# Altium project Power_Box_V0.PrjPcb (part 1 of 2)
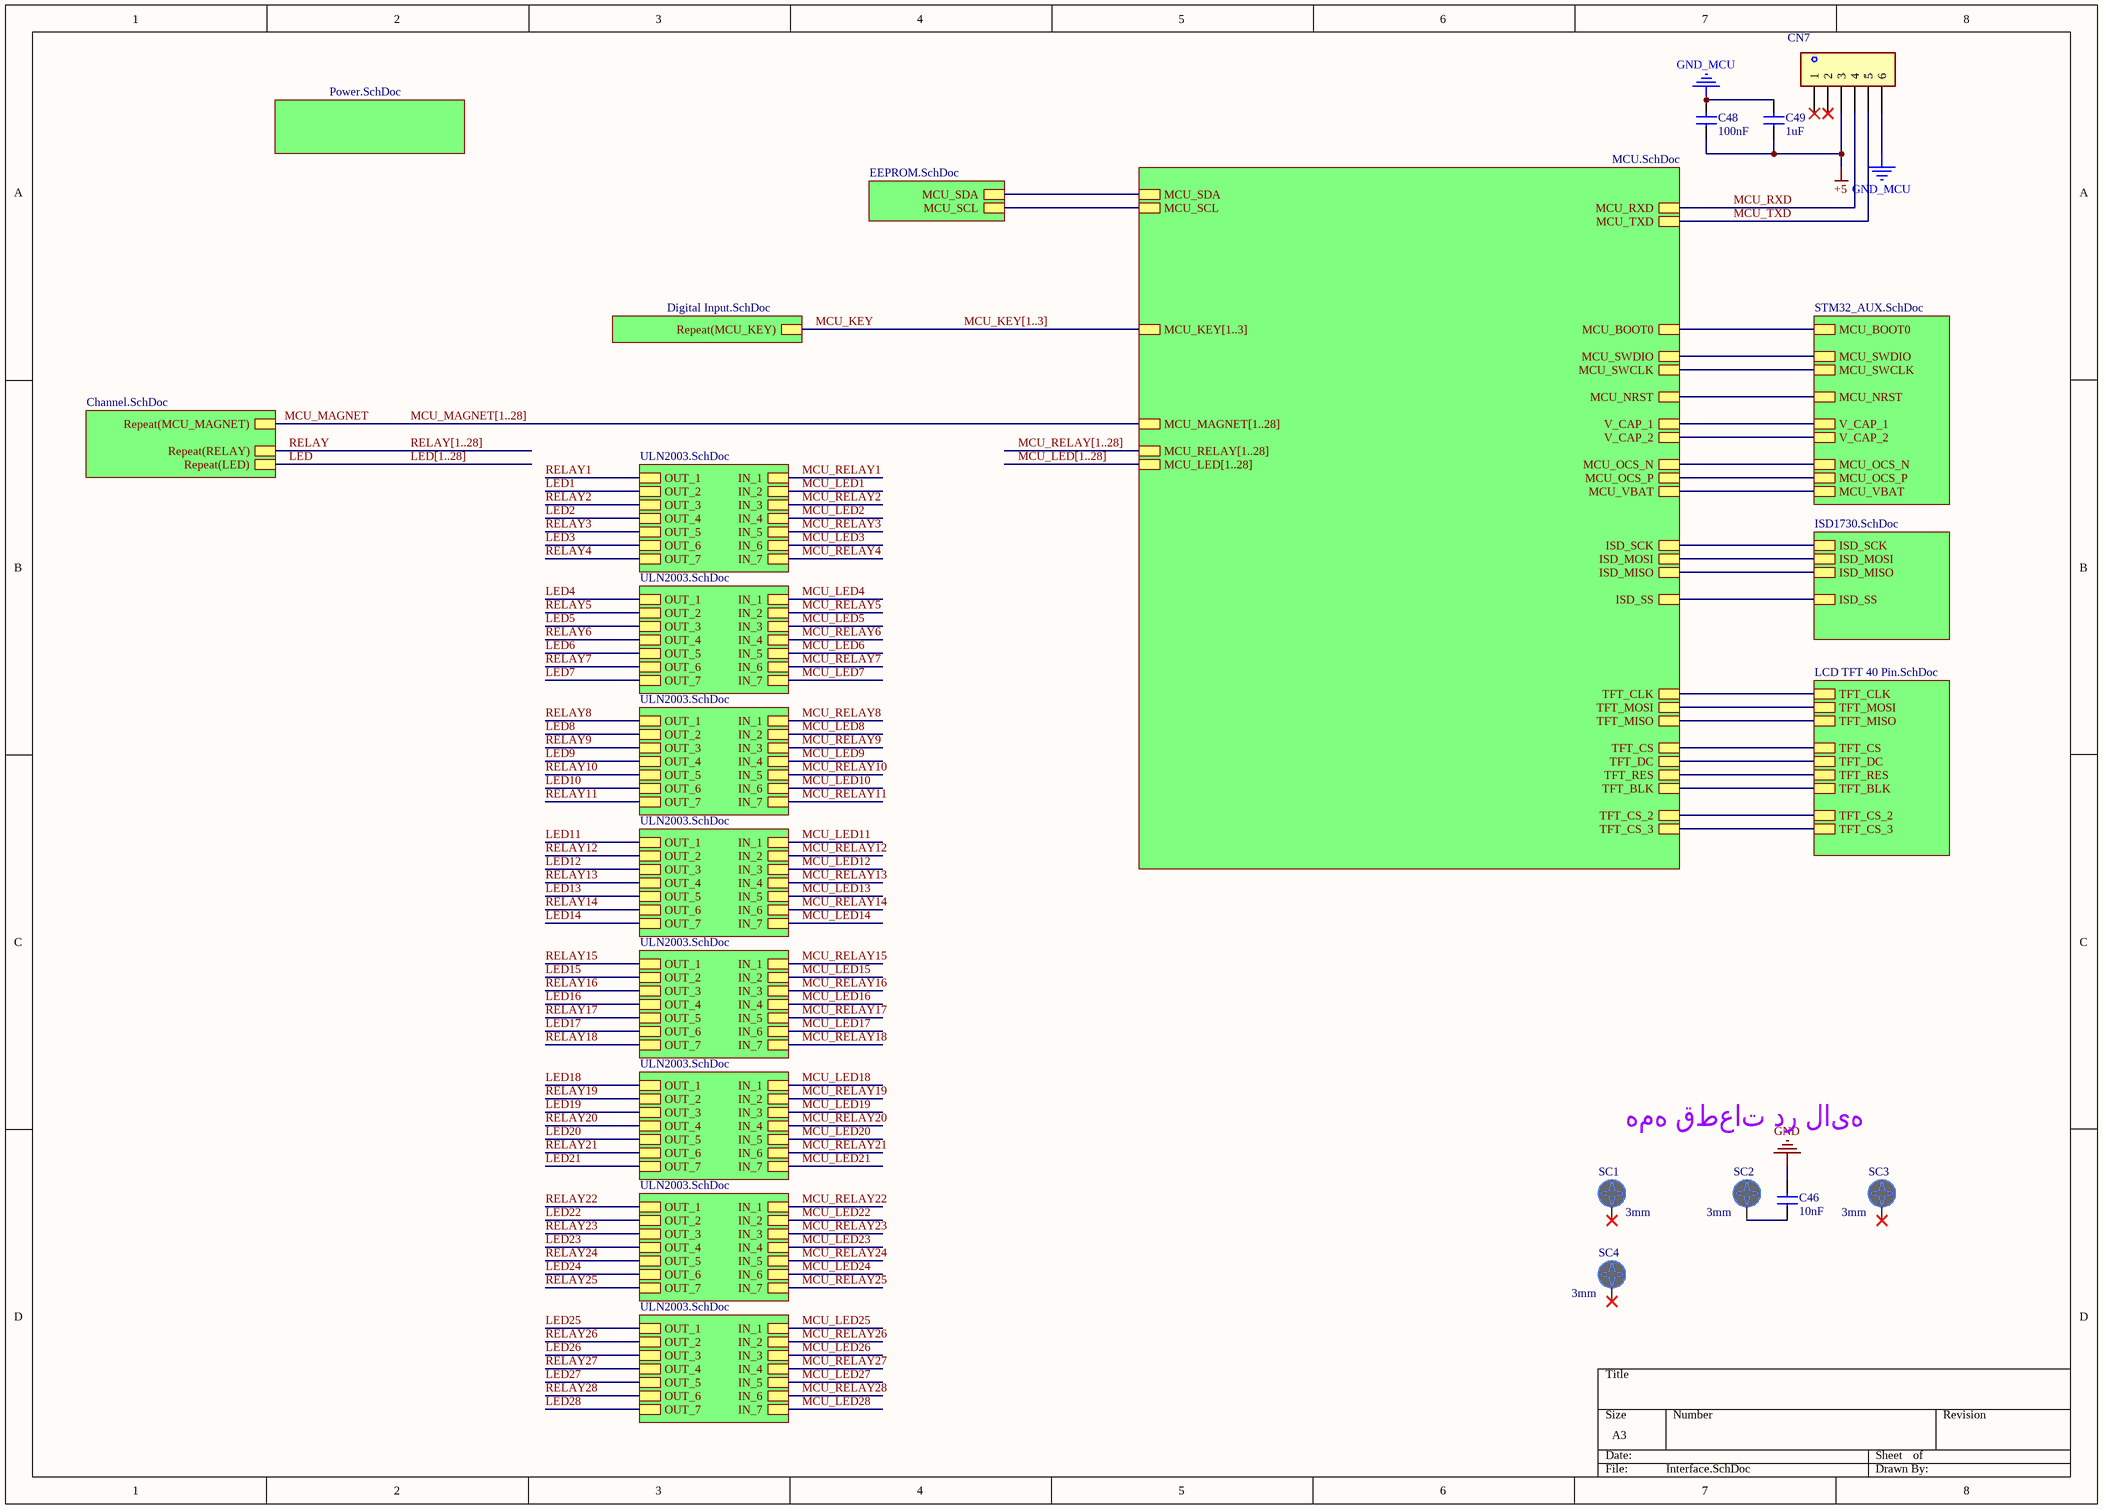
[diagram p0: Interface.SchDoc]
10 sheets, 400 parts. Net scope: hierarchical (ports join the sheet entries above them; power ports are global).
Board file: Power_Box_V0.PcbDoc
Sheets:
  Interface.SchDoc
    MCU = MCU.SchDoc
    STM_AUX = STM32_AUX.SchDoc
    TFT = LCD TFT 40 Pin.SchDoc
    ISD1730 = ISD1730.SchDoc
    EEPROM = EEPROM.SchDoc
    KEY1 = Digital Input.SchDoc
    KEY2 = Digital Input.SchDoc
    KEY3 = Digital Input.SchDoc
    Power = Power.SchDoc
    ULN2003_1 = ULN2003.SchDoc
    CHANNEL1 = Channel.SchDoc
    CHANNEL2 = Channel.SchDoc
    CHANNEL3 = Channel.SchDoc
    CHANNEL4 = Channel.SchDoc
    CHANNEL5 = Channel.SchDoc
    CHANNEL6 = Channel.SchDoc
    CHANNEL7 = Channel.SchDoc
    CHANNEL8 = Channel.SchDoc
    CHANNEL9 = Channel.SchDoc
    CHANNEL10 = Channel.SchDoc
    CHANNEL11 = Channel.SchDoc
    CHANNEL12 = Channel.SchDoc
    CHANNEL13 = Channel.SchDoc
    CHANNEL14 = Channel.SchDoc
    CHANNEL15 = Channel.SchDoc
    CHANNEL16 = Channel.SchDoc
    CHANNEL17 = Channel.SchDoc
    CHANNEL18 = Channel.SchDoc
    CHANNEL19 = Channel.SchDoc
    CHANNEL20 = Channel.SchDoc
    CHANNEL21 = Channel.SchDoc
    CHANNEL22 = Channel.SchDoc
    CHANNEL23 = Channel.SchDoc
    CHANNEL24 = Channel.SchDoc
    CHANNEL25 = Channel.SchDoc
    CHANNEL26 = Channel.SchDoc
    CHANNEL27 = Channel.SchDoc
    CHANNEL28 = Channel.SchDoc
    ULN2003_2 = ULN2003.SchDoc
    ULN2003_3 = ULN2003.SchDoc
    ULN2003_4 = ULN2003.SchDoc
    ULN2003_5 = ULN2003.SchDoc
    ULN2003_6 = ULN2003.SchDoc
    ULN2003_7 = ULN2003.SchDoc
    ULN2003_8 = ULN2003.SchDoc

## Sheet Interface.SchDoc
size A3; SheetNumber: 1; SheetTotal: 10

### Parts
C46  value 10nF  [CAP-CER-13x5-Ls10]  (hidden comment: CAP Cer 10nF-1KV-X7R-THD)
C48  value 100nF  [C-0805]  (hidden comment: CAP Cer 100nF-50V-X7R-SMD)
C49  value 1uF  [C-0805]  (hidden comment: CAP Cer 1uF-50V-X7R-SMD)
CN7  Connector XH/VH/TE-Straight/Right-THD/SMD-?mm  [XH-6]  (value not drawn)
SC1  Size: 3mm  [Screw_M3]  (hidden comment: Screw 3mm)
SC2  Size: 3mm  [Screw_M3]  (hidden comment: Screw 3mm)
SC3  Size: 3mm  [Screw_M3]  (hidden comment: Screw 3mm)
SC4  Size: 3mm  [Screw_M3]  (hidden comment: Screw 3mm)

### Sub-sheets
EEPROM = EEPROM.SchDoc: MCU_SDA, MCU_SCL
ISD1730 = ISD1730.SchDoc: ISD_SCK, ISD_MOSI, ISD_MISO, ISD_SS
MCU = MCU.SchDoc: MCU_BOOT0, MCU_SWCLK, MCU_SWDIO, MCU_NRST, V_CAP_1, V_CAP_2, MCU_OCS_N, MCU_OCS_P, TFT_CS, TFT_CLK, TFT_DC, TFT_MOSI, TFT_MISO, TFT_RES, TFT_BLK, ISD_SCK, ISD_MOSI, ISD_MISO, ISD_SS, MCU_SDA, MCU_SCL, MCU_KEY[1..3], MCU_RELAY[1..28], MCU_LED[1..28], MCU_MAGNET[1..28], MCU_TXD, MCU_RXD, MCU_VBAT, TFT_CS_2, TFT_CS_3
Power = Power.SchDoc: no entries
Repeat(CHANNEL, 1, 28) = Channel.SchDoc: Repeat(RELAY), Repeat(LED), Repeat(MCU_MAGNET)
Repeat(KEY, 1, 3) = Digital Input.SchDoc: Repeat(MCU_KEY)
STM_AUX = STM32_AUX.SchDoc: MCU_BOOT0, MCU_SWCLK, MCU_SWDIO, MCU_NRST, V_CAP_1, V_CAP_2, MCU_OCS_N, MCU_OCS_P, MCU_VBAT
TFT = LCD TFT 40 Pin.SchDoc: TFT_CS, TFT_CLK, TFT_DC, TFT_MOSI, TFT_MISO, TFT_RES, TFT_BLK, TFT_CS_2, TFT_CS_3
ULN2003_1 = ULN2003.SchDoc: IN_1, IN_2, IN_3, IN_4, IN_5, IN_6, IN_7, OUT_1, OUT_2, OUT_3, OUT_4, OUT_5, OUT_6, OUT_7
ULN2003_2 = ULN2003.SchDoc: IN_1, IN_2, IN_3, IN_4, IN_5, IN_6, IN_7, OUT_1, OUT_2, OUT_3, OUT_4, OUT_5, OUT_6, OUT_7
ULN2003_3 = ULN2003.SchDoc: IN_1, IN_2, IN_3, IN_4, IN_5, IN_6, IN_7, OUT_1, OUT_2, OUT_3, OUT_4, OUT_5, OUT_6, OUT_7
ULN2003_4 = ULN2003.SchDoc: IN_1, IN_2, IN_3, IN_4, IN_5, IN_6, IN_7, OUT_1, OUT_2, OUT_3, OUT_4, OUT_5, OUT_6, OUT_7
ULN2003_5 = ULN2003.SchDoc: IN_1, IN_2, IN_3, IN_4, IN_5, IN_6, IN_7, OUT_1, OUT_2, OUT_3, OUT_4, OUT_5, OUT_6, OUT_7
ULN2003_6 = ULN2003.SchDoc: IN_1, IN_2, IN_3, IN_4, IN_5, IN_6, IN_7, OUT_1, OUT_2, OUT_3, OUT_4, OUT_5, OUT_6, OUT_7
ULN2003_7 = ULN2003.SchDoc: IN_1, IN_2, IN_3, IN_4, IN_5, IN_6, IN_7, OUT_1, OUT_2, OUT_3, OUT_4, OUT_5, OUT_6, OUT_7
ULN2003_8 = ULN2003.SchDoc: IN_1, IN_2, IN_3, IN_4, IN_5, IN_6, IN_7, OUT_1, OUT_2, OUT_3, OUT_4, OUT_5, OUT_6, OUT_7

### Nets
+5: C48.1 C49.1 CN7.3
GND: C46.2
GND_MCU: C48.2 C49.2 CN7.6
ISD_MISO: sheet MCU/ISD_MISO, sheet ISD1730/ISD_MISO
ISD_MOSI: sheet MCU/ISD_MOSI, sheet ISD1730/ISD_MOSI
ISD_SCK: sheet MCU/ISD_SCK, sheet ISD1730/ISD_SCK
ISD_SS: sheet MCU/ISD_SS, sheet ISD1730/ISD_SS
LED: sheet Repeat(CHANNEL, 1, 28)/Repeat(LED)
MCU_BOOT0: sheet MCU/MCU_BOOT0, sheet STM_AUX/MCU_BOOT0
MCU_KEY: sheet Repeat(KEY, 1, 3)/Repeat(MCU_KEY)  [also labelled MCU_KEY[1..3]]
MCU_MAGNET: sheet Repeat(CHANNEL, 1, 28)/Repeat(MCU_MAGNET)
MCU_NRST: sheet MCU/MCU_NRST, sheet STM_AUX/MCU_NRST
MCU_OCS_N: sheet MCU/MCU_OCS_N, sheet STM_AUX/MCU_OCS_N
MCU_OCS_P: sheet MCU/MCU_OCS_P, sheet STM_AUX/MCU_OCS_P
MCU_RXD: CN7.4 ; sheet MCU/MCU_RXD
MCU_SCL: sheet MCU/MCU_SCL, sheet EEPROM/MCU_SCL
MCU_SDA: sheet MCU/MCU_SDA, sheet EEPROM/MCU_SDA
MCU_SWCLK: sheet MCU/MCU_SWCLK, sheet STM_AUX/MCU_SWCLK
MCU_SWDIO: sheet MCU/MCU_SWDIO, sheet STM_AUX/MCU_SWDIO
MCU_TXD: CN7.5 ; sheet MCU/MCU_TXD
MCU_VBAT: sheet MCU/MCU_VBAT, sheet STM_AUX/MCU_VBAT
RELAY: sheet Repeat(CHANNEL, 1, 28)/Repeat(RELAY)
TFT_BLK: sheet MCU/TFT_BLK, sheet TFT/TFT_BLK
TFT_CLK: sheet MCU/TFT_CLK, sheet TFT/TFT_CLK
TFT_CS: sheet MCU/TFT_CS, sheet TFT/TFT_CS
TFT_CS_2: sheet MCU/TFT_CS_2, sheet TFT/TFT_CS_2
TFT_CS_3: sheet MCU/TFT_CS_3, sheet TFT/TFT_CS_3
TFT_DC: sheet MCU/TFT_DC, sheet TFT/TFT_DC
TFT_MISO: sheet MCU/TFT_MISO, sheet TFT/TFT_MISO
TFT_MOSI: sheet MCU/TFT_MOSI, sheet TFT/TFT_MOSI
TFT_RES: sheet MCU/TFT_RES, sheet TFT/TFT_RES
V_CAP_1: sheet MCU/V_CAP_1, sheet STM_AUX/V_CAP_1
V_CAP_2: sheet MCU/V_CAP_2, sheet STM_AUX/V_CAP_2
NetC46_1: C46.1 SC2.1

Not connected (* = marked no-connect by the designer): CN7 1* 2*; SC1 1*; SC3 1*; SC4 1*

### Buses and harness runs
bus LED[1..28]
bus MCU_LED[1..28] = sheet MCU/MCU_LED[1..28]
bus MCU_MAGNET[1..28] = sheet MCU/MCU_MAGNET[1..28]
bus MCU_RELAY[1..28] = sheet MCU/MCU_RELAY[1..28]
bus RELAY[1..28]

### Notes on the sheet
- همه قطعات در لایه بالا قرار بگیرند

### Library data of the parts
C46 = CAP-CER: CAPACITOR; Phone Number: 0915 8700 314; Voltage: 1KV; Tolerance: X7R; Type: THD; Publisher: Mahdi Bagherzadeh; ComponentLink1Description: Linkedin; ComponentLink1URL: https://ir.linkedin.com/in/mahdi-bagherzade; Published Date: 9-15-2024
C48 C49 = CAP-CER: CAPACITOR; Phone Number: 0915 8700 314; Voltage: 50V; Tolerance: X7R; Type: SMD; Publisher: Mahdi Bagherzadeh; ComponentLink1Description: Linkedin; ComponentLink1URL: https://ir.linkedin.com/in/mahdi-bagherzade; Published Date: 9-15-2024
CN7 = CN-6pin: CONNECTOR; Phone Number: 0915 8700 314; Publisher: Mahdi Bagherzadeh; ComponentLink1Description: Linkedin; ComponentLink1URL: https://ir.linkedin.com/in/mahdi-bagherzade; Published Date: 9-15-2024; Size: ?mm; Type: Straight/Right-THD/SMD; Value: XH/VH/TE
SC1-SC4 = SCREW: Phone Number: 0915 8700 314; Publisher: Mahdi Bagherzadeh; ComponentLink1Description: Linkedin; ComponentLink1URL: https://ir.linkedin.com/in/mahdi-bagherzade; Published Date: 9-15-2024

## Sheet MCU.SchDoc
size A3; SheetNumber: 7; SheetTotal: 10
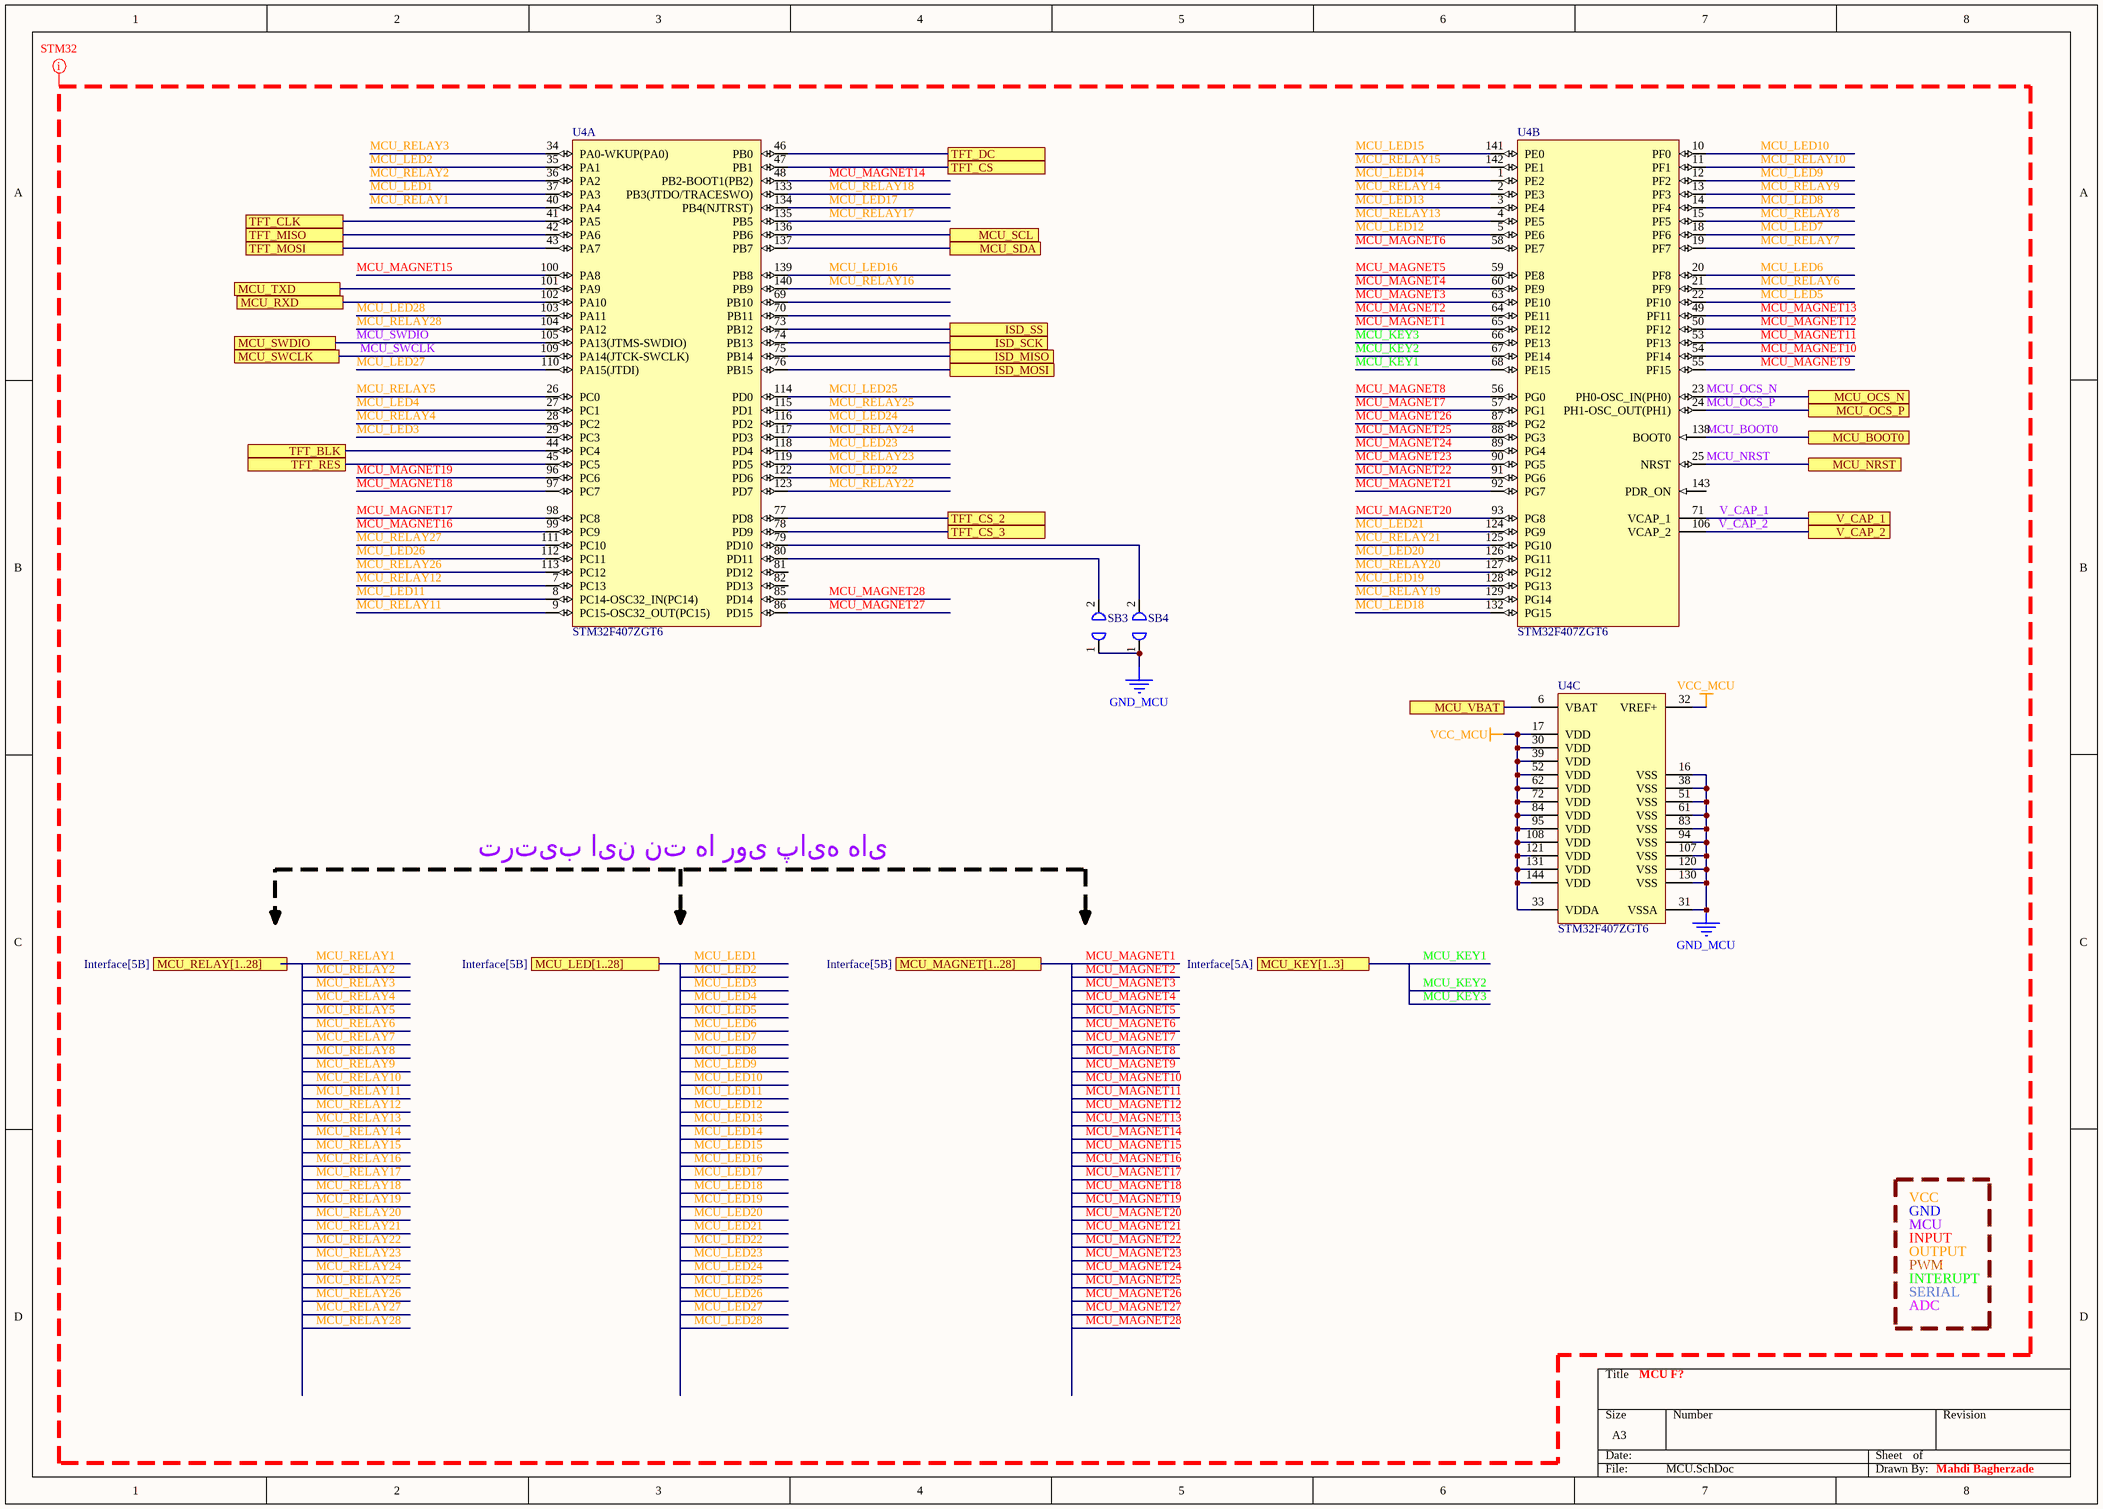
[diagram p1: MCU.SchDoc]

### Parts
SB3  SOLDER BRIDGE-2  [SB-ARC]  (value not drawn)  (net tie, no BOM)
SB4  SOLDER BRIDGE-2  [SB-ARC]  (value not drawn)  (net tie, no BOM)
U4  STM32F407ZGT6  [STM-LQFP144_M]  (parts A,B,C of 3)

### Ports
ISD_MISO (see Interface[7B], ISD1730[1B]), ISD_MOSI (see Interface[7B], ISD1730[1B]), ISD_SCK (see Interface[7B], ISD1730[1B]), ISD_SS (see Interface[7B], ISD1730[1B]), MCU_BOOT0 (see Interface[7A], STM32_AUX[1B]), MCU_KEY[1..3] (see Interface[5A]), MCU_LED[1..28] (see Interface[5B]), MCU_MAGNET[1..28] (see Interface[5B]), MCU_NRST (see Interface[7B], STM32_AUX[3A]), MCU_OCS_N (see Interface[7B], STM32_AUX[4A]), MCU_OCS_P (see Interface[7B], STM32_AUX[4A]), MCU_RELAY[1..28] (see Interface[5B]), MCU_RXD (see Interface[7A]), MCU_SCL (see Interface[5A], EEPROM[3B]), MCU_SDA (see Interface[5A], EEPROM[3B]), MCU_SWCLK (see Interface[7A], STM32_AUX[2B]), MCU_SWDIO (see Interface[7A], STM32_AUX[1B]), MCU_TXD (see Interface[7A]), MCU_VBAT (see Interface[7B], STM32_AUX[1D]), TFT_BLK (see Interface[7C], LCD TFT 40 Pin[1B]), TFT_CLK (see Interface[7B], LCD TFT 40 Pin[1A]), TFT_CS (see Interface[7B], LCD TFT 40 Pin[1A]), TFT_CS_2 (see Interface[7C], LCD TFT 40 Pin[1B]), TFT_CS_3 (see Interface[7C], LCD TFT 40 Pin[1B]), TFT_DC (see Interface[7C], LCD TFT 40 Pin[1A]), TFT_MISO (see Interface[7B], LCD TFT 40 Pin[1A]), TFT_MOSI (see Interface[7B], LCD TFT 40 Pin[1A]), TFT_RES (see Interface[7C], LCD TFT 40 Pin[1B]), V_CAP_1 (see Interface[7B], STM32_AUX[3C]), V_CAP_2 (see Interface[7B], STM32_AUX[3C])

### Nets
GND_MCU: SB3.1 SB4.1 U4.16(VSS) U4.31(VSSA) U4.38(VSS) U4.51(VSS) U4.61(VSS) U4.83(VSS) U4.94(VSS) U4.107(VSS) U4.120(VSS) U4.130(VSS)
VCC_MCU: U4.17(VDD) U4.30(VDD) U4.32(VREF+) U4.33(VDDA) U4.39(VDD) U4.52(VDD) U4.62(VDD) U4.72(VDD) U4.84(VDD) U4.95(VDD) U4.108(VDD) U4.121(VDD) U4.131(VDD) U4.144(VDD)
ISD_MISO: U4.75(PB14) ; port ISD_MISO
ISD_MOSI: U4.76(PB15) ; port ISD_MOSI
ISD_SCK: U4.74(PB13) ; port ISD_SCK
ISD_SS: U4.73(PB12) ; port ISD_SS
MCU_BOOT0: U4.138(BOOT0) ; port MCU_BOOT0
MCU_KEY1: U4.68(PE15)
MCU_KEY2: U4.67(PE14)
MCU_KEY3: U4.66(PE13)
MCU_LED1: U4.37(PA3)
MCU_LED2: U4.35(PA1)
MCU_LED3: U4.29(PC3)
MCU_LED4: U4.27(PC1)
MCU_LED5: U4.22(PF10)
MCU_LED6: U4.20(PF8)
MCU_LED7: U4.18(PF6)
MCU_LED8: U4.14(PF4)
MCU_LED9: U4.12(PF2)
MCU_LED10: U4.10(PF0)
MCU_LED11: U4.8(PC14-OSC32_IN(PC14))
MCU_LED12: U4.5(PE6)
MCU_LED13: U4.3(PE4)
MCU_LED14: U4.1(PE2)
MCU_LED15: U4.141(PE0)
MCU_LED16: U4.139(PB8)
MCU_LED17: U4.134(PB4(NJTRST))
MCU_LED18: U4.132(PG15)
MCU_LED19: U4.128(PG13)
MCU_LED20: U4.126(PG11)
MCU_LED21: U4.124(PG9)
MCU_LED22: U4.122(PD6)
MCU_LED23: U4.118(PD4)
MCU_LED24: U4.116(PD2)
MCU_LED25: U4.114(PD0)
MCU_LED26: U4.112(PC11)
MCU_LED27: U4.110(PA15(JTDI))
MCU_LED28: U4.103(PA11)
MCU_MAGNET1: U4.65(PE12)
MCU_MAGNET2: U4.64(PE11)
MCU_MAGNET3: U4.63(PE10)
MCU_MAGNET4: U4.60(PE9)
MCU_MAGNET5: U4.59(PE8)
MCU_MAGNET6: U4.58(PE7)
MCU_MAGNET7: U4.57(PG1)
MCU_MAGNET8: U4.56(PG0)
MCU_MAGNET9: U4.55(PF15)
MCU_MAGNET10: U4.54(PF14)
MCU_MAGNET11: U4.53(PF13)
MCU_MAGNET12: U4.50(PF12)
MCU_MAGNET13: U4.49(PF11)
MCU_MAGNET14: U4.48(PB2-BOOT1(PB2))
MCU_MAGNET15: U4.100(PA8)
MCU_MAGNET16: U4.99(PC9)
MCU_MAGNET17: U4.98(PC8)
MCU_MAGNET18: U4.97(PC7)
MCU_MAGNET19: U4.96(PC6)
MCU_MAGNET20: U4.93(PG8)
MCU_MAGNET21: U4.92(PG7)
MCU_MAGNET22: U4.91(PG6)
MCU_MAGNET23: U4.90(PG5)
MCU_MAGNET24: U4.89(PG4)
MCU_MAGNET25: U4.88(PG3)
MCU_MAGNET26: U4.87(PG2)
MCU_MAGNET27: U4.86(PD15)
MCU_MAGNET28: U4.85(PD14)
MCU_NRST: U4.25(NRST) ; port MCU_NRST
MCU_OCS_N: U4.23(PH0-OSC_IN(PH0)) ; port MCU_OCS_N
MCU_OCS_P: U4.24(PH1-OSC_OUT(PH1)) ; port MCU_OCS_P
MCU_RELAY1: U4.40(PA4)
MCU_RELAY2: U4.36(PA2)
MCU_RELAY3: U4.34(PA0-WKUP(PA0))
MCU_RELAY4: U4.28(PC2)
MCU_RELAY5: U4.26(PC0)
MCU_RELAY6: U4.21(PF9)
MCU_RELAY7: U4.19(PF7)
MCU_RELAY8: U4.15(PF5)
MCU_RELAY9: U4.13(PF3)
MCU_RELAY10: U4.11(PF1)
MCU_RELAY11: U4.9(PC15-OSC32_OUT(PC15))
MCU_RELAY12: U4.7(PC13)
MCU_RELAY13: U4.4(PE5)
MCU_RELAY14: U4.2(PE3)
MCU_RELAY15: U4.142(PE1)
MCU_RELAY16: U4.140(PB9)
MCU_RELAY17: U4.135(PB5)
MCU_RELAY18: U4.133(PB3(JTDO/TRACESWO))
MCU_RELAY19: U4.129(PG14)
MCU_RELAY20: U4.127(PG12)
MCU_RELAY21: U4.125(PG10)
MCU_RELAY22: U4.123(PD7)
MCU_RELAY23: U4.119(PD5)
MCU_RELAY24: U4.117(PD3)
MCU_RELAY25: U4.115(PD1)
MCU_RELAY26: U4.113(PC12)
MCU_RELAY27: U4.111(PC10)
MCU_RELAY28: U4.104(PA12)
MCU_RXD: U4.102(PA10) ; port MCU_RXD
MCU_SCL: U4.136(PB6) ; port MCU_SCL
MCU_SDA: U4.137(PB7) ; port MCU_SDA
MCU_SWCLK: U4.109(PA14(JTCK-SWCLK)) ; port MCU_SWCLK
MCU_SWDIO: U4.105(PA13(JTMS-SWDIO)) ; port MCU_SWDIO
MCU_TXD: U4.101(PA9) ; port MCU_TXD
MCU_VBAT: U4.6(VBAT) ; port MCU_VBAT
TFT_BLK: U4.44(PC4) ; port TFT_BLK
TFT_CLK: U4.41(PA5) ; port TFT_CLK
TFT_CS: U4.47(PB1) ; port TFT_CS
TFT_CS_2: U4.77(PD8) ; port TFT_CS_2
TFT_CS_3: U4.78(PD9) ; port TFT_CS_3
TFT_DC: U4.46(PB0) ; port TFT_DC
TFT_MISO: U4.42(PA6) ; port TFT_MISO
TFT_MOSI: U4.43(PA7) ; port TFT_MOSI
TFT_RES: U4.45(PC5) ; port TFT_RES
V_CAP_1: U4.71(VCAP_1) ; port V_CAP_1
V_CAP_2: U4.106(VCAP_2) ; port V_CAP_2
NetSB3_2: SB3.2 U4.80(PD11)
NetSB4_2: SB4.2 U4.79(PD10)

Not connected (* = marked no-connect by the designer): U4 69(PB10) 70(PB11) 81(PD12) 82(PD13) 143(PDR_ON)

### Layout directives
net class STM32: GND_MCU, MCU_BOOT0, MCU_KEY1, MCU_KEY2, MCU_KEY3, MCU_LED1, MCU_LED2, MCU_LED3, MCU_LED4, MCU_LED5, MCU_LED6, MCU_LED7, MCU_LED8, MCU_LED9, MCU_LED10, MCU_LED11, MCU_LED12, MCU_LED13, MCU_LED14, MCU_LED15, MCU_LED16, MCU_LED17, MCU_LED18, MCU_LED19, MCU_LED20, MCU_LED21, MCU_LED22, MCU_LED23, MCU_LED24, MCU_LED25, MCU_LED26, MCU_LED27, MCU_LED28, MCU_MAGNET1, MCU_MAGNET2, MCU_MAGNET3, MCU_MAGNET4, MCU_MAGNET5, MCU_MAGNET6, MCU_MAGNET7, MCU_MAGNET8, MCU_MAGNET9, MCU_MAGNET10, MCU_MAGNET11, MCU_MAGNET12, MCU_MAGNET13, MCU_MAGNET14, MCU_MAGNET15, MCU_MAGNET16, MCU_MAGNET17, MCU_MAGNET18, MCU_MAGNET19, MCU_MAGNET20, MCU_MAGNET21, MCU_MAGNET22, MCU_MAGNET23, MCU_MAGNET24, MCU_MAGNET25, MCU_MAGNET26, MCU_MAGNET27, MCU_MAGNET28, MCU_NRST, MCU_OCS_N, MCU_OCS_P, MCU_RELAY1, MCU_RELAY2, MCU_RELAY3, MCU_RELAY4, MCU_RELAY5, MCU_RELAY6, MCU_RELAY7, MCU_RELAY8, MCU_RELAY9, MCU_RELAY10, MCU_RELAY11, MCU_RELAY12, MCU_RELAY13, MCU_RELAY14, MCU_RELAY15, MCU_RELAY16, MCU_RELAY17, MCU_RELAY18, MCU_RELAY19, MCU_RELAY20, MCU_RELAY21, MCU_RELAY22, MCU_RELAY23, MCU_RELAY24, MCU_RELAY25, MCU_RELAY26, MCU_RELAY27, MCU_RELAY28, MCU_SWCLK, MCU_SWDIO, V_CAP_1, V_CAP_2, VCC_MCU

### Notes on the sheet
- ترتیب این نت ها روی پایه های میکرو میتوانند با هم تعویض شوند
- INPUT
- OUTPUT
- MCU
- GND
- VCC
- INTERUPT
- SERIAL
- ADC
- PWM
- MCU F?
- Mahdi Bagherzade

### Library data of the parts
SB3 SB4 = SOLDER BRIDGE-2: Phone Number: 0915 8700 314; Publisher: Mahdi Bagherzadeh; ComponentLink1Description: Linkedin; ComponentLink1URL: https://ir.linkedin.com/in/mahdi-bagherzade; Published Date: 9-15-2024
U4 = STM32F407ZGT6: ARM Cortex-M4 32-bit MCU+FPU, 210 DMIPS, 1024 kB Flash, 192 kB Internal RAM, 114 I/Os, 144-pin LQFP, -40 to 85 degC, Tray; Manufacturer: STMicroelectronics; D/A Converter: 2x12-bit; FLASH Size (Prog) (kB): 1024; I/Os (High Current): 114; Internal RAM Size (kB): 192; Operating Frequency(F) (Processor speed) (MHz): 168; Supply Voltage(Vcc) max (V): 3.6; Supply Voltage(Vcc) min (V): 1.8; DatasheetVersion: Rev. 4; PackageVersion: Rev. 4, 06/2013; PackageReference: LQFP144; PackageDescription: 144-Pin Low Profile Quad Flat Package, 20 x 20 mm Body, 0.5 mm Pitch; Supplier 1: Digi-Key; Supplier Part Number 1: 497-11766-ND; Supplier 2: Newark; Supplier Part Number 2: 73T2334; Supplier 3: Mouser; Supplier Part Number 3: 511-STM32F407ZGT6; Core: ARM Cortex-M4; Packing: Tray; Mounting Technology: Surface Mount; PartNumber: STM32F407ZGT6; ComponentLink1Description: Manufacturer URL; ComponentLink1URL: http://www.st.com/web/en/home.html; ComponentLink2Description: Datasheet; ComponentLink2URL: http://www.st.com/st-web-ui/static/active/en/resource/technical/document/datasheet/DM00037051.pdf; ComponentLink3Description: Package Specification; ComponentLink3URL: http://www.st.com/st-web-ui/static/active/en/resource/technical/document/datasheet/DM00037051.pdf

## Sheet STM32_AUX.SchDoc
size A4; SheetNumber: 8; SheetTotal: 10
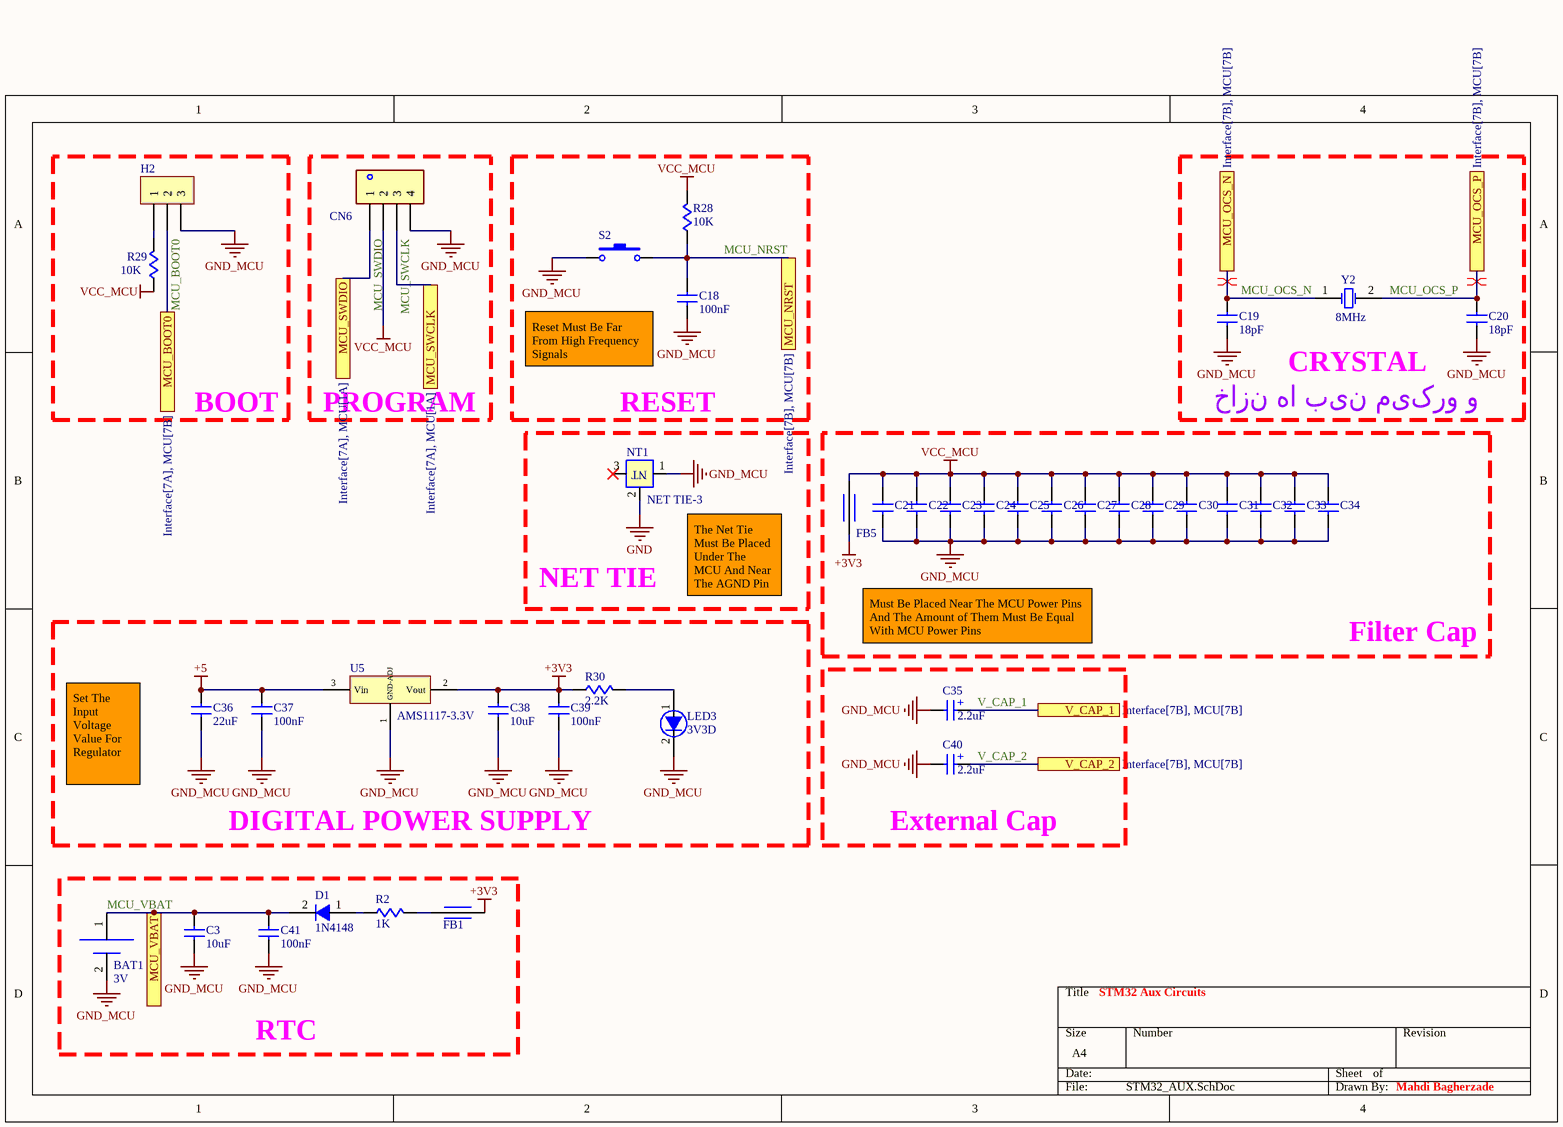
[diagram p2: STM32_AUX.SchDoc]

### Parts
BAT1  Voltage: 3V  [BAT-HOLDER-SMD-3V]  (hidden comment: Bat Holder 2016-SMD)
C3  value 10uF  [C-0805]  (hidden comment: CAP Cer 10uF-50V-X7R-SMD)
C18  value 100nF  [C-0805]  (hidden comment: CAP Cer 100nF-50V-X7R-SMD)
C19  value 18pF  [C-0805]  (hidden comment: CAP Cer 18pF-50V-X7R-SMD)
C20  value 18pF  [C-0805]  (hidden comment: CAP Cer 18pF-50V-X7R-SMD)
C21  CAP Cer 100nF-50V-X7R-SMD  [C-0805]  (value not drawn)
C22  CAP Cer 100nF-50V-X7R-SMD  [C-0805]  (value not drawn)
C23  CAP Cer 100nF-50V-X7R-SMD  [C-0805]  (value not drawn)
C24  CAP Cer 100nF-50V-X7R-SMD  [C-0805]  (value not drawn)
C25  CAP Cer 100nF-50V-X7R-SMD  [C-0805]  (value not drawn)
C26  CAP Cer 100nF-50V-X7R-SMD  [C-0805]  (value not drawn)
C27  CAP Cer 100nF-50V-X7R-SMD  [C-0805]  (value not drawn)
C28  CAP Cer 100nF-50V-X7R-SMD  [C-0805]  (value not drawn)
C29  CAP Cer 100nF-50V-X7R-SMD  [C-0805]  (value not drawn)
C30  CAP Cer 100nF-50V-X7R-SMD  [C-0805]  (value not drawn)
C31  CAP Cer 100nF-50V-X7R-SMD  [C-0805]  (value not drawn)
C32  CAP Cer 100nF-50V-X7R-SMD  [C-0805]  (value not drawn)
C33  CAP Cer 100nF-50V-X7R-SMD  [C-0805]  (value not drawn)
C34  CAP Cer 100nF-50V-X7R-SMD  [C-0805]  (value not drawn)
C35  value 2.2uF  [TAN-A]
C36  value 22uF  [C-0805]  (hidden comment: CAP Cer 22uF-50V-X7R-SMD)
C37  value 100nF  [C-0805]  (hidden comment: CAP Cer 100nF-50V-X7R-SMD)
C38  value 10uF  [C-0805]  (hidden comment: CAP Cer 10uF-50V-X7R-SMD)
C39  value 100nF  [C-0805]  (hidden comment: CAP Cer 100nF-50V-X7R-SMD)
C40  value 2.2uF  [TAN-A]
C41  value 100nF  [C-0805]  (hidden comment: CAP Cer 100nF-50V-X7R-SMD)
CN6  Connector XH/VH/TE-Straight/Right-THD/SMD-?mm  [XH-4]  (value not drawn)
D1  Code: 1N4148  [SOD80]  (hidden comment: Diode 1N4148-SMD)
FB1  Ferrite Bead SMD  [FB-0805]  (value not drawn)
FB5  FERRITE BEAD  [FB-0805]  (value not drawn)
H2  BOOT  [H-3pin-M-S]  (value not drawn)
LED3  3V3D  [LED-1206-R]
NT1  NET TIE-3  [NET TIE-3]  (net tie, no BOM)
R2  value 1K  [R-0805]  (hidden comment: RES 1K-5%-1/8W-SMD)
R28  value 10K  [R-0805]
R29  value 10K  [R-0805]
R30  value 2.2K  [R-0805]
S2  RESET  [SW-SMD-2pin-3x6]  (value not drawn)
U5  AMS1117-3.3V  [SOT223]
Y2  value 8MHz  [CRYSTAL-SMD]

### Blocks framed on the sheet
BOOT: H2 R29
PROGRAM: CN6
RESET: C18 R28 S2
CRYSTAL: C19 C20 Y2
Filter Cap: C21-C34 FB5
DIGITAL POWER SUPPLY: C36-C39 LED3 R30 U5
External Cap: C35 C40
RTC: BAT1 C3 C41 D1 FB1 R2

### Ports
MCU_BOOT0 (see Interface[7A], MCU[7B]), MCU_NRST (see Interface[7B], MCU[7B]), MCU_OCS_N (see Interface[7B], MCU[7B]), MCU_OCS_P (see Interface[7B], MCU[7B]), MCU_SWCLK (see Interface[7A], MCU[1A]), MCU_SWDIO (see Interface[7A], MCU[1A]), MCU_VBAT, V_CAP_1 (see Interface[7B], MCU[7B]), V_CAP_2 (see Interface[7B], MCU[7B])

### Nets
+3V3: C38.1 C39.1 FB1.1 FB5.1 R30.1 U5.2(Vout)
+5: C36.1 C37.1 U5.3(Vin)
GND: NT1.2
GND_MCU: BAT1.2(-) C3.1 C18.2 C19.2 C20.2 C21.2 C22.2 C23.2 C24.2 C25.2 C26.2 C27.2 C28.2 C29.2 C30.2 C31.2 C32.2 C33.2 C34.2 C35.2 C36.2 C37.2 C38.2 C39.2 C40.2 C41.1 CN6.4 H2.3 LED3.2(C) NT1.1 S2.1 U5.1(GND-ADJ)
VCC_MCU: C21.1 C22.1 C23.1 C24.1 C25.1 C26.1 C27.1 C28.1 C29.1 C30.1 C31.1 C32.1 C33.1 C34.1 CN6.2 FB5.2 R28.2 R29.1
MCU_BOOT0: H2.2 ; port MCU_BOOT0
MCU_NRST: C18.1 R28.1 S2.2 ; port MCU_NRST
MCU_OCS_N: C19.1 Y2.1(OSC1) ; port MCU_OCS_N
MCU_OCS_P: C20.1 Y2.2(OSC2) ; port MCU_OCS_P
MCU_SWCLK: CN6.3 ; port MCU_SWCLK
MCU_SWDIO: CN6.1 ; port MCU_SWDIO
MCU_VBAT: BAT1.1(+) C3.2 C41.2 D1.2(C) ; port MCU_VBAT
V_CAP_1: C35.1 ; port V_CAP_1
V_CAP_2: C40.1 ; port V_CAP_2
NetD1_1: D1.1(A) R2.1
NetFB1_2: FB1.2 R2.2
NetH2_1: H2.1 R29.2
NetLED3_1: LED3.1(A) R30.2

Not connected (* = marked no-connect by the designer): NT1 3*

### Layout directives
differential pair: MCU_OCS_N, MCU_OCS_P

### Notes on the sheet
- Reset Must Be Far From High Frequency Signals
- خازن ها بین میکرو و کریستال قرار بگیرند
- NET TIE
- The Net Tie Must Be Placed Under The MCU And Near The AGND Pin
- Must Be Placed Near The MCU Power Pins And The Amount of Them Must Be Equal With MCU Power Pins
- Set The Input Voltage Value For Regulator
- STM32 Aux Circuits
- Mahdi Bagherzade
- (in symbol CAP-TAN) +
- (in symbol NET TIE-3) NT

### Library data of the parts
BAT1 = BATTERY HOLDER: BATTERY; Phone Number: 0915 8700 314; Publisher: Mahdi Bagherzadeh; ComponentLink1Description: Linkedin; ComponentLink1URL: https://ir.linkedin.com/in/mahdi-bagherzade; Published Date: 9-15-2024; Size: 2016; Type: SMD
C3 C18-C20 C36-C39 C41 = CAP-CER: as C48 on sheet Interface; Publisher: Mahdi Bagherzadeh; ComponentLink1Description: Linkedin; ComponentLink1URL: https://ir.linkedin.com/in/mahdi-bagherzade; Published Date: 9-15-2024
C21-C34 = CAP-CER: CAPACITOR; Phone Number: 0915 8700 314; Voltage: 50V; Tolerance: X7R; Type: SMD; Value: 100nF; Publisher: Mahdi Bagherzadeh; ComponentLink1Description: Linkedin; ComponentLink1URL: https://ir.linkedin.com/in/mahdi-bagherzade; Published Date: 9-15-2024
C35 C40 = CAP-TAN: CAPACITOR; Phone Number: 0915 8700 314; Voltage: 16V; Publisher: Mahdi Bagherzadeh; ComponentLink1Description: Linkedin; ComponentLink1URL: https://ir.linkedin.com/in/mahdi-bagherzade; Published Date: 9-15-2024; Power: -; Size: A; Tolerance: -
CN6 = CN-4pin: CONNECTOR; Phone Number: 0915 8700 314; Publisher: Mahdi Bagherzadeh; ComponentLink1Description: Linkedin; ComponentLink1URL: https://ir.linkedin.com/in/mahdi-bagherzade; Published Date: 9-15-2024; Size: ?mm; Type: Straight/Right-THD/SMD; Value: XH/VH/TE
D1 = DIODE: Phone Number: 0915 8700 314; Type: SMD; Publisher: Mahdi Bagherzadeh; ComponentLink1Description: Linkedin; ComponentLink1URL: https://ir.linkedin.com/in/mahdi-bagherzade; Published Date: 9-15-2024
FB1 FB5 = FERRITE BEAD: INDUCATOR; Phone Number: 0915 8700 314; Publisher: Mahdi Bagherzadeh; ComponentLink1Description: Linkedin; ComponentLink1URL: https://ir.linkedin.com/in/mahdi-bagherzade; Published Date: 9-15-2024
  FB1: Type: SMD
H2 = HEADER-3pin: HEADER; Phone Number: 0915 8700 314; Publisher: Mahdi Bagherzadeh; ComponentLink1Description: Linkedin; ComponentLink1URL: https://ir.linkedin.com/in/mahdi-bagherzade; Published Date: 9-15-2024; Type: MALE-STRAIGHT
LED3 = LED: Phone Number: 0915 8700 314; Color: RED; Publisher: Mahdi Bagherzadeh; ComponentLink1Description: Linkedin; ComponentLink1URL: https://ir.linkedin.com/in/mahdi-bagherzade; Published Date: 9-15-2024; Size: 0805
NT1 = NET TIE-3: Phone Number: 0915 8700 314; Publisher: Mahdi Bagherzadeh; ComponentLink1Description: Linkedin; ComponentLink1URL: https://ir.linkedin.com/in/mahdi-bagherzade; Published Date: 9-15-2024
R2 = RES: RESISTOR; Phone Number: 0915 8700 314; Tolerance: 5%; Power: 1/8W; Publisher: Mahdi Bagherzadeh; ComponentLink1Description: Linkedin; ComponentLink1URL: https://ir.linkedin.com/in/mahdi-bagherzade; Published Date: 9-15-2024; Type: SMD
R28-R30 = RES: RESISTOR; Phone Number: 0915 8700 314; Power: 1/8W; Tolerance: 5%; Publisher: Mahdi Bagherzadeh; ComponentLink1Description: Linkedin; ComponentLink1URL: https://ir.linkedin.com/in/mahdi-bagherzade; Published Date: 9-15-2024
S2 = PUSH BUTTON: SWITCH; Phone Number: 0915 8700 314; Publisher: Mahdi Bagherzadeh; ComponentLink1Description: Linkedin; ComponentLink1URL: https://ir.linkedin.com/in/mahdi-bagherzade; Published Date: 9-15-2024; Size: 3x6mm-2Pin
U5 = AMS1117: REGULATOR; Phone Number: 0915 8700 314; Voltage: ?V; Publisher: Mahdi Bagherzadeh; ComponentLink1Description: Linkedin; ComponentLink1URL: https://ir.linkedin.com/in/mahdi-bagherzade; Published Date: 9-15-2024
Y2 = CRYSTAL: Phone Number: 0915 8700 314; Publisher: Mahdi Bagherzadeh; ComponentLink1Description: Linkedin; ComponentLink1URL: https://ir.linkedin.com/in/mahdi-bagherzade; Published Date: 9-15-2024

## Sheet LCD TFT 40 Pin.SchDoc
size A; SheetNumber: 6; SheetTotal: 10
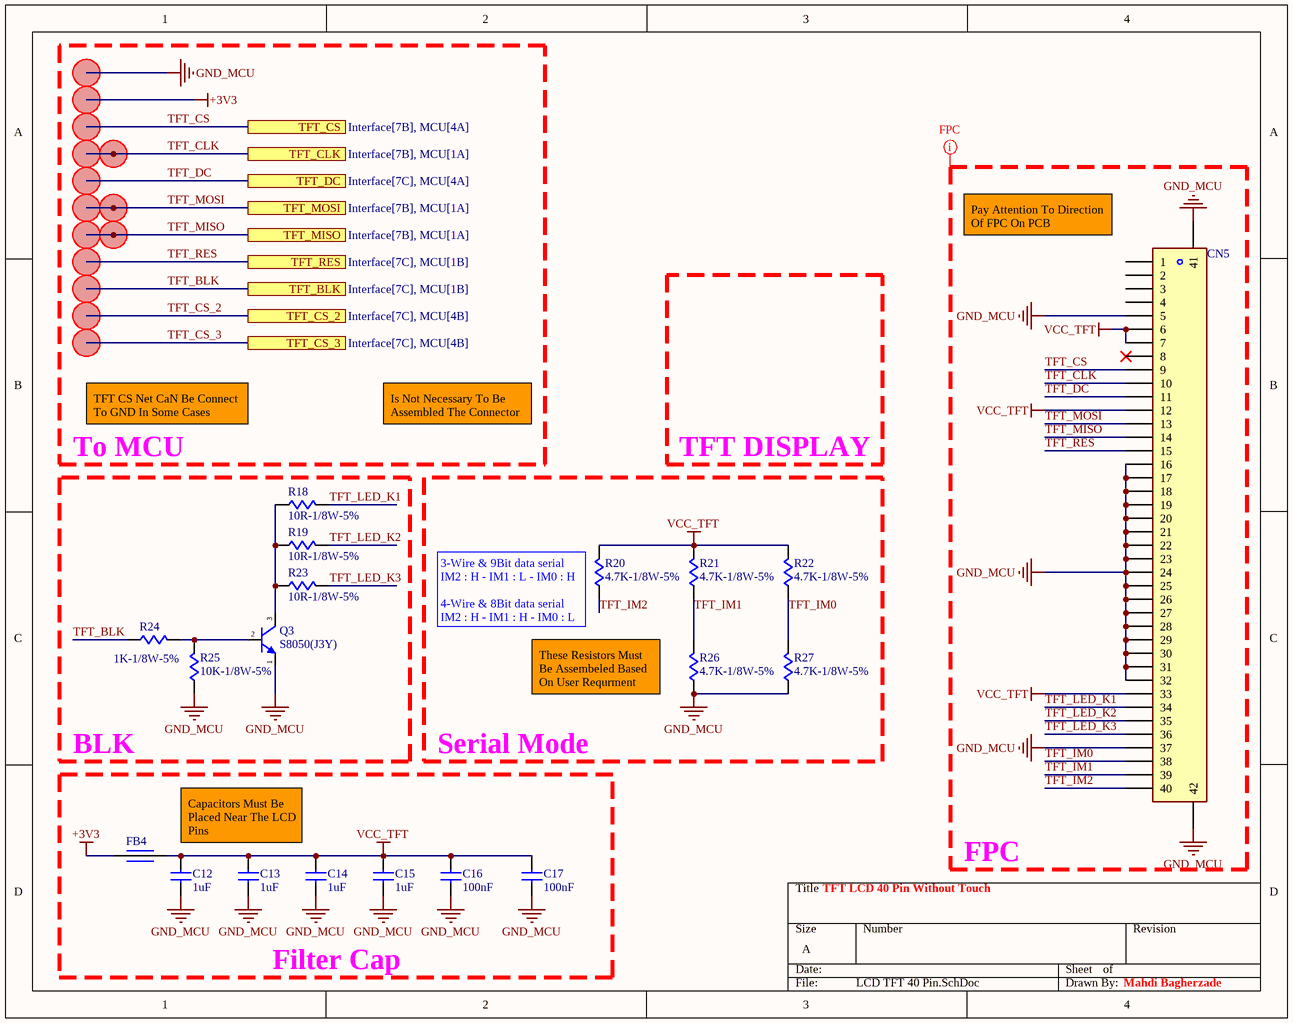
[diagram p3: LCD TFT 40 Pin.SchDoc]

### Parts
C12  value 1uF  [C-0805]  (hidden comment: CAP Cer 1uF-50V-X7R-SMD)
C13  value 1uF  [C-0805]  (hidden comment: CAP Cer 1uF-50V-X7R-SMD)
C14  value 1uF  [C-0805]  (hidden comment: CAP Cer 1uF-50V-X7R-SMD)
C15  value 1uF  [C-0805]  (hidden comment: CAP Cer 1uF-50V-X7R-SMD)
C16  value 100nF  [C-0805]  (hidden comment: CAP Cer 100nF-50V-X7R-SMD)
C17  value 100nF  [C-0805]  (hidden comment: CAP Cer 100nF-50V-X7R-SMD)
CN5  0.5mm-Horizontal  [CN-FPC-40-0.5mm-hor]  (value not drawn)
FB4  FERRITE BEAD  [FB-0805]  (value not drawn)
Q3  S8050(J3Y)  [SOT23-213]
R18  10R-1/8W-5%  [R-0805]
R19  10R-1/8W-5%  [R-0805]
R20  4.7K-1/8W-5%  [R-0805]
R21  4.7K-1/8W-5%  [R-0805]
R22  4.7K-1/8W-5%  [R-0805]
R23  10R-1/8W-5%  [R-0805]
R24  1K-1/8W-5%  [R-0805]
R25  10K-1/8W-5%  [R-0805]
R26  4.7K-1/8W-5%  [R-0805]
R27  4.7K-1/8W-5%  [R-0805]
TP1  (no value)  [TEST POINT-DIP]  (net tie, no BOM)
TP2  (no value)  [TEST POINT-DIP]  (net tie, no BOM)
TP3  (no value)  [TEST POINT-DIP]  (net tie, no BOM)
TP4  (no value)  [TEST POINT-DIP]  (net tie, no BOM)
TP5  (no value)  [TEST POINT-DIP]  (net tie, no BOM)
TP6  (no value)  [TEST POINT-DIP]  (net tie, no BOM)
TP7  (no value)  [TEST POINT-DIP]  (net tie, no BOM)
TP8  (no value)  [TEST POINT-DIP]  (net tie, no BOM)
TP9  (no value)  [TEST POINT-DIP]  (net tie, no BOM)
TP10  (no value)  [TEST POINT-DIP]  (net tie, no BOM)
TP11  (no value)  [TEST POINT-DIP]  (net tie, no BOM)
TP12  (no value)  [TEST POINT-DIP]  (net tie, no BOM)
TP13  (no value)  [TEST POINT-DIP]  (net tie, no BOM)
TP14  (no value)  [TEST POINT-DIP]  (net tie, no BOM)

### Blocks framed on the sheet
To MCU: TP1-TP14

### Ports
TFT_BLK (see Interface[7C], MCU[1B]), TFT_CLK (see Interface[7B], MCU[1A]), TFT_CS (see Interface[7B], MCU[4A]), TFT_CS_2 (see Interface[7C], MCU[4B]), TFT_CS_3 (see Interface[7C], MCU[4B]), TFT_DC (see Interface[7C], MCU[4A]), TFT_MISO (see Interface[7B], MCU[1A]), TFT_MOSI (see Interface[7B], MCU[1A]), TFT_RES (see Interface[7C], MCU[1B])

### Nets
+3V3: FB4.1 TP2.1(TP)
GND_MCU: C12.2 C13.2 C14.2 C15.2 C16.2 C17.2 CN5.5 CN5.16 CN5.17 CN5.18 CN5.19 CN5.20 CN5.21 CN5.22 CN5.23 CN5.24 CN5.25 CN5.26 CN5.27 CN5.28 CN5.29 CN5.30 CN5.31 CN5.32 CN5.37 CN5.41 CN5.42 Q3.1(E) R25.1 R26.1 R27.1 TP1.1(TP)
VCC_TFT: C12.1 C13.1 C14.1 C15.1 C16.1 C17.1 CN5.6 CN5.7 CN5.12 CN5.33 FB4.2 R20.2 R21.2 R22.2
TFT_BLK: R24.1 TP9.1(TP) ; port TFT_BLK
TFT_CLK: CN5.10 TP4.1(TP) TP10.1(TP) ; port TFT_CLK
TFT_CS: CN5.9 TP3.1(TP) ; port TFT_CS
TFT_CS_2: TP13.1(TP) ; port TFT_CS_2
TFT_CS_3: TP14.1(TP) ; port TFT_CS_3
TFT_DC: CN5.11 TP5.1(TP) ; port TFT_DC
TFT_IM0: CN5.38 R22.1 R27.2
TFT_IM1: CN5.39 R21.1 R26.2
TFT_IM2: CN5.40 R20.1
TFT_LED_K1: CN5.34 R18.2
TFT_LED_K2: CN5.35 R19.2
TFT_LED_K3: CN5.36 R23.2
TFT_MISO: CN5.14 TP7.1(TP) TP12.1(TP) ; port TFT_MISO
TFT_MOSI: CN5.13 TP6.1(TP) TP11.1(TP) ; port TFT_MOSI
TFT_RES: CN5.15 TP8.1(TP) ; port TFT_RES
NetQ3_2: Q3.2(B) R24.2 R25.2
NetQ3_3: Q3.3(C) R18.1 R19.1 R23.1

Not connected (* = marked no-connect by the designer): CN5 1 2 3 4 8*

### Layout directives
net class FPC: GND_MCU, TFT_CLK, TFT_CS, TFT_DC, TFT_IM0, TFT_IM1, TFT_IM2, TFT_LED_K1, TFT_LED_K2, TFT_LED_K3, TFT_MISO, TFT_MOSI, TFT_RES, VCC_TFT

### Notes on the sheet
- (near CN5) Pay Attention To Direction Of FPC On PCB
- (near TP14) TFT CS Net CaN Be Connect To GND In Some Cases
- Is Not Necessary To Be Assembled The Connector
- TFT DISPLAY
- (near R20) 3-Wire & 9Bit data serial
  IM2 : H - IM1 : L - IM0 : H
  4-Wire & 8Bit data serial
  IM2 : H - IM1 : H - IM0 : L
- These Resistors Must Be Assembeled Based On User Requrment
- BLK
- Serial Mode
- Capacitors Must Be Placed Near The LCD Pins
- TFT LCD 40 Pin Without Touch
- FPC
- Filter Cap
- Mahdi Bagherzade

### Library data of the parts
C12-C17 = CAP-CER: as C48 on sheet Interface; Publisher: Mahdi Bagherzadeh; ComponentLink1Description: Linkedin; ComponentLink1URL: https://ir.linkedin.com/in/mahdi-bagherzade; Published Date: 9-15-2024
CN5 = CN-FPC-40pin: CONNECTOR; Phone Number: 0915 8700 314; Publisher: Mahdi Bagherzadeh; ComponentLink1Description: Linkedin; ComponentLink1URL: https://ir.linkedin.com/in/mahdi-bagherzade; Published Date: 9-15-2024
FB4 = FERRITE BEAD: INDUCATOR; Phone Number: 0915 8700 314; Publisher: Mahdi Bagherzadeh; ComponentLink1Description: Linkedin; ComponentLink1URL: https://ir.linkedin.com/in/mahdi-bagherzade; Published Date: 9-15-2024
Q3 = S8050: TRANSISTOR; Phone Number: 0915 8700 314; Publisher: Mahdi Bagherzadeh; ComponentLink1Description: Linkedin; ComponentLink1URL: https://ir.linkedin.com/in/mahdi-bagherzade; Published Date: 9-15-2024
R18-R27 = RES: RESISTOR; Phone Number: 0915 8700 314; Publisher: Mahdi Bagherzadeh; ComponentLink1Description: Linkedin; ComponentLink1URL: https://ir.linkedin.com/in/mahdi-bagherzade; Published Date: 9-15-2024
TP1-TP14 = TEST PIONT: Phone Number: 0915 8700 314; Publisher: Mahdi Bagherzadeh; ComponentLink1Description: Linkedin; ComponentLink1URL: https://ir.linkedin.com/in/mahdi-bagherzade; Published Date: 9-15-2024

## Sheet ISD1730.SchDoc
size A; SheetNumber: 5; SheetTotal: 10
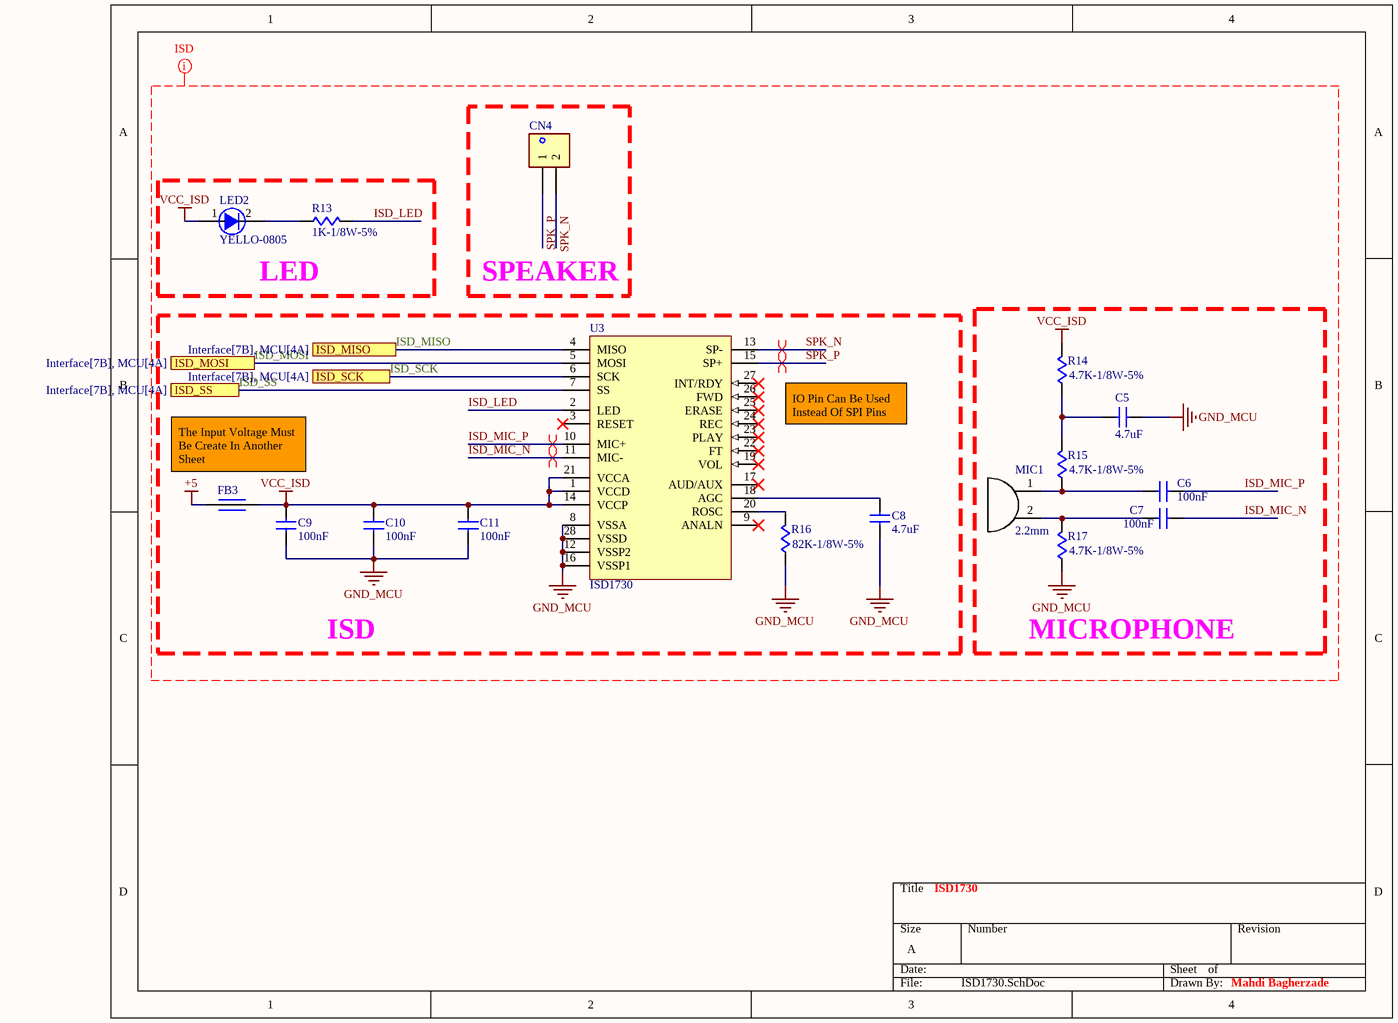
[diagram p4: ISD1730.SchDoc]

### Parts
C5  value 4.7uF  [C-0805]  (hidden comment: CAP Cer 4.7uF-50V-X7R-SMD)
C6  value 100nF  [C-0805]  (hidden comment: CAP Cer 100nF-50V-X7R-SMD)
C7  value 100nF  [C-0805]  (hidden comment: CAP Cer 100nF-50V-X7R-SMD)
C8  value 4.7uF  [C-0805]  (hidden comment: CAP Cer 4.7uF-50V-X7R-SMD)
C9  value 100nF  [C-0805]  (hidden comment: CAP Cer 100nF-50V-X7R-SMD)
C10  value 100nF  [C-0805]  (hidden comment: CAP Cer 100nF-50V-X7R-SMD)
C11  value 100nF  [C-0805]  (hidden comment: CAP Cer 100nF-50V-X7R-SMD)
CN4  XH-2  [XH-2]  (value not drawn)
FB3  FERRITE BEAD  [FB-0805]  (value not drawn)
LED2  YELLO-0805  [LED-1206-G]
MIC1  2.2mm  [MIC-2.2mm]
R13  1K-1/8W-5%  [R-0805]
R14  4.7K-1/8W-5%  [R-0805]
R15  4.7K-1/8W-5%  [R-0805]
R16  82K-1/8W-5%  [R-0805]
R17  4.7K-1/8W-5%  [R-0805]
U3  ISD1730  [DIP28-wide]

### Blocks framed on the sheet
SPEAKER: CN4
LED: LED2 R13
ISD: C8-C11 FB3 R16 U3
MICROPHONE: C5-C7 MIC1 R14 R15 R17

### Ports
ISD_MISO (see Interface[7B], MCU[4A]), ISD_MOSI (see Interface[7B], MCU[4A]), ISD_SCK (see Interface[7B], MCU[4A]), ISD_SS (see Interface[7B], MCU[4A])

### Nets
+5: FB3.1
GND_MCU: C5.2 C8.2 C9.2 C10.2 C11.2 R16.1 R17.1 U3.8(VSSA) U3.12(VSSP2) U3.16(VSSP1) U3.28(VSSD)
VCC_ISD: C9.1 C10.1 C11.1 FB3.2 LED2.1(A) R14.2 U3.1(VCCD) U3.14(VCCP) U3.21(VCCA)
ISD_LED: R13.2 U3.2(LED)
ISD_MIC_N: C7.2 U3.11(MIC-)
ISD_MIC_P: C6.2 U3.10(MIC+)
ISD_MISO: U3.4(MISO) ; port ISD_MISO
ISD_MOSI: U3.5(MOSI) ; port ISD_MOSI
ISD_SCK: U3.6(SCK) ; port ISD_SCK
ISD_SS: U3.7(SS) ; port ISD_SS
SPK_N: CN4.2 U3.13(SP-)
SPK_P: CN4.1 U3.15(SP+)
NetC5_1: C5.1 R14.1 R15.2
NetC6_1: C6.1 MIC1.1 R15.1
NetC7_1: C7.1 MIC1.2 R17.2
NetC8_1: C8.1 U3.18(AGC)
NetLED2_2: LED2.2(C) R13.1
NetR16_2: R16.2 U3.20(ROSC)

Not connected (* = marked no-connect by the designer): U3 3(RESET)* 9(ANALN)* 17(AUD/AUX)* 19(VOL)* 22(FT)* 23(PLAY)* 24(REC)* 25(ERASE)* 26(FWD)* 27(INT/RDY)*

### Layout directives
differential pair: ISD_MIC_N, ISD_MIC_P, SPK_N, SPK_P
net class ISD: +5, GND_MCU, ISD_LED, ISD_MIC_N, ISD_MIC_P, ISD_MISO, ISD_MOSI, ISD_SCK, ISD_SS, SPK_N, SPK_P, VCC_ISD

### Notes on the sheet
- IO Pin Can Be Used Instead Of SPI Pins
- The Input Voltage Must Be Create In Another Sheet
- ISD1730
- Mahdi Bagherzade

### Library data of the parts
C5-C11 = CAP-CER: as C48 on sheet Interface; Publisher: Mahdi Bagherzadeh; ComponentLink1Description: Linkedin; ComponentLink1URL: https://ir.linkedin.com/in/mahdi-bagherzade; Published Date: 9-15-2024
CN4 = CN-2pin: CONNECTOR; Phone Number: 0915 8700 314; Publisher: Mahdi Bagherzadeh; ComponentLink1Description: Linkedin; ComponentLink1URL: https://ir.linkedin.com/in/mahdi-bagherzade; Published Date: 9-15-2024
FB3 = FERRITE BEAD: INDUCATOR; Phone Number: 0915 8700 314; Publisher: Mahdi Bagherzadeh; ComponentLink1Description: Linkedin; ComponentLink1URL: https://ir.linkedin.com/in/mahdi-bagherzade; Published Date: 9-15-2024
LED2 = LED: Phone Number: 0915 8700 314; Publisher: Mahdi Bagherzadeh; ComponentLink1Description: Linkedin; ComponentLink1URL: https://ir.linkedin.com/in/mahdi-bagherzade; Published Date: 9-15-2024
MIC1 = MIC: Phone Number: 0915 8700 314; Publisher: Mahdi Bagherzadeh; ComponentLink1Description: Linkedin; ComponentLink1URL: https://ir.linkedin.com/in/mahdi-bagherzade; Published Date: 9-15-2024
R13-R17 = RES: RESISTOR; Phone Number: 0915 8700 314; Publisher: Mahdi Bagherzadeh; ComponentLink1Description: Linkedin; ComponentLink1URL: https://ir.linkedin.com/in/mahdi-bagherzade; Published Date: 9-15-2024
U3 = ISD1730: IC; Phone Number: 0915 8700 314; Publisher: Mahdi Bagherzadeh; ComponentLink1Description: Linkedin; ComponentLink1URL: https://ir.linkedin.com/in/mahdi-bagherzade; Published Date: 9-15-2024

## Sheet EEPROM.SchDoc
size A; SheetNumber: 5; SheetTotal: 11
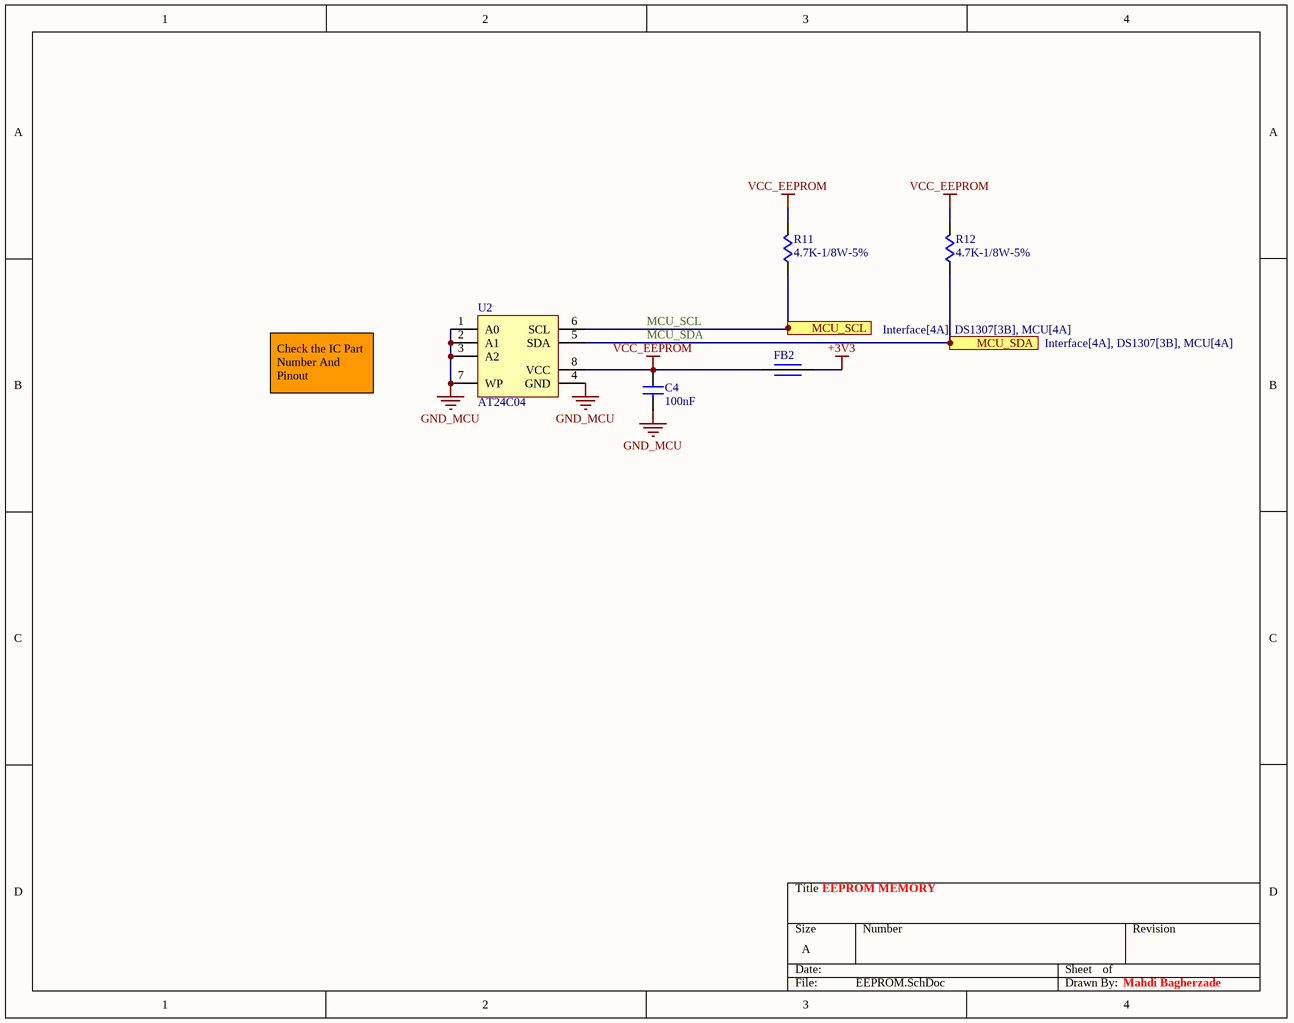
[diagram p5: EEPROM.SchDoc]

### Parts
C4  value 100nF  [C-0805]  (hidden comment: CAP Cer 100nF-50V-X7R-SMD)
FB2  FERRITE BEAD  [FB-0805]  (value not drawn)
R11  4.7K-1/8W-5%  [R-0805]
R12  4.7K-1/8W-5%  [R-0805]
U2  AT24C04  [SOIC8]

### Ports
MCU_SCL (see Interface[4A], DS1307[3B], MCU[4A]), MCU_SDA (see Interface[4A], DS1307[3B], MCU[4A])

### Nets
+3V3: FB2.2
GND_MCU: C4.2 U2.1(A0) U2.2(A1) U2.3(A2) U2.4(GND) U2.7(WP)
VCC_EEPROM: C4.1 FB2.1 R11.2 R12.2 U2.8(VCC)
MCU_SCL: R11.1 U2.6(SCL) ; port MCU_SCL
MCU_SDA: R12.1 U2.5(SDA) ; port MCU_SDA

### Notes on the sheet
- Check the IC Part Number And Pinout
- EEPROM MEMORY
- Mahdi Bagherzade

### Library data of the parts
C4 = CAP-CER: as C48 on sheet Interface; Publisher: Mahdi Bagherzadeh; ComponentLink1Description: Linkedin; ComponentLink1URL: https://ir.linkedin.com/in/mahdi-bagherzade; Published Date: 9-15-2024
FB2 = FERRITE BEAD: INDUCATOR; Phone Number: 0915 8700 314; Publisher: Mahdi Bagherzadeh; ComponentLink1Description: Linkedin; ComponentLink1URL: https://ir.linkedin.com/in/mahdi-bagherzade; Published Date: 9-15-2024
R11 R12 = RES: RESISTOR; Phone Number: 0915 8700 314; Publisher: Mahdi Bagherzadeh; ComponentLink1Description: Linkedin; ComponentLink1URL: https://ir.linkedin.com/in/mahdi-bagherzade; Published Date: 9-15-2024
U2 = AT24C04: IC; Phone Number: 0915 8700 314; Publisher: Mahdi Bagherzadeh; ComponentLink1Description: Linkedin; ComponentLink1URL: https://ir.linkedin.com/in/mahdi-bagherzade; Published Date: 9-15-2024

## Sheet Digital Input.SchDoc
size A; SheetNumber: 2; SheetTotal: 10
Used 3 times, as channels KEY1, KEY2, KEY3. Parts and nets are listed once, with the designators drawn on the sheet.
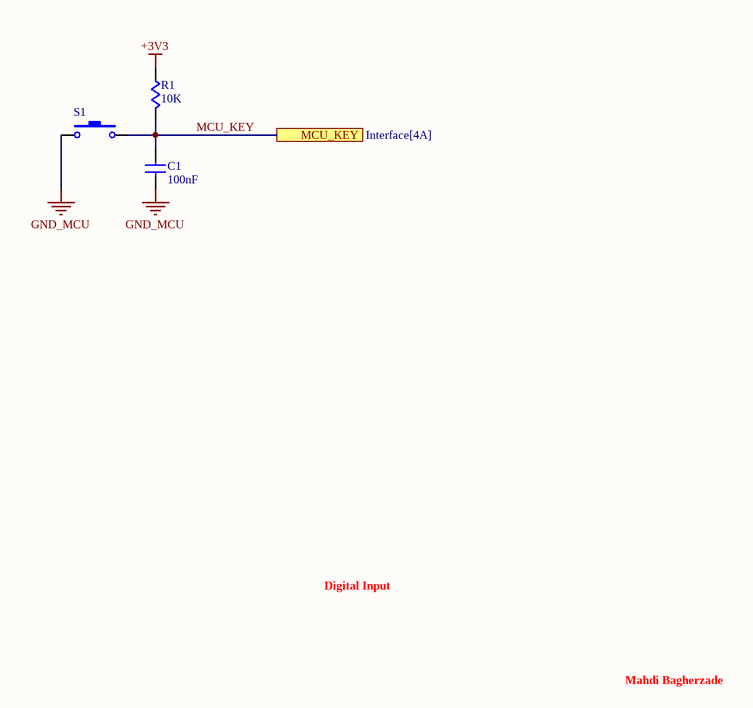
[diagram p6: Digital Input.SchDoc]

### Parts
C1  value 100nF  [C-0805]  (hidden comment: CAP Cer 100nF-50V-X7R-SMD)
R1  value 10K  [R-0805]
S1  UP  [SW-SMD-2pin-3x6]  (value not drawn)

### Ports
MCU_KEY (see Interface[4A])

### Nets
+3V3: R1.1
GND_MCU: C1.2 S1.1
MCU_KEY: C1.1 R1.2 S1.2 ; port MCU_KEY

### Channels
KEY1: designators end in _1; ports MCU_KEY=MCU_KEY_KEY1
KEY2: designators end in _2; ports MCU_KEY=MCU_KEY_KEY2
KEY3: designators end in _3; ports MCU_KEY=MCU_KEY_KEY3

### Notes on the sheet
- Digital Input
- Mahdi Bagherzade

### Library data of the parts
C1 = CAP-CER: as C48 on sheet Interface; Publisher: Mahdi Bagherzadeh; ComponentLink1Description: Linkedin; ComponentLink1URL: https://ir.linkedin.com/in/mahdi-bagherzade; Published Date: 9-15-2024
R1 = RES: as R2 on sheet STM32_AUX; Publisher: Mahdi Bagherzadeh; ComponentLink1Description: Linkedin; ComponentLink1URL: https://ir.linkedin.com/in/mahdi-bagherzade; Published Date: 9-15-2024
S1 = PUSH BUTTON: SWITCH; Phone Number: 0915 8700 314; Publisher: Mahdi Bagherzadeh; ComponentLink1Description: Linkedin; ComponentLink1URL: https://ir.linkedin.com/in/mahdi-bagherzade; Published Date: 9-15-2024; Size: 6x6

## Sheet Power.SchDoc
size A4; SheetNumber: 9; SheetTotal: 10
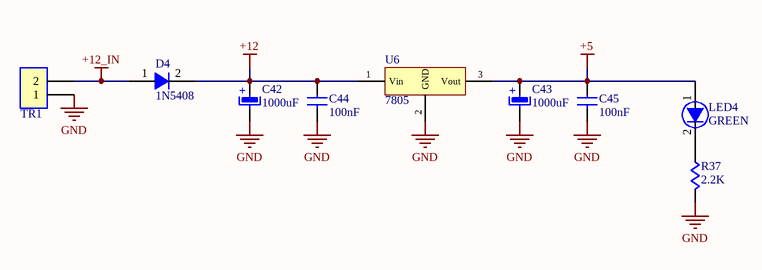
[diagram p7: Power.SchDoc]

### Parts
C42  value 1000uF  [CAP-Elec-10x25-5]  (hidden comment: CAP Elec 1000uF-25V-10x25-THD)
C43  value 1000uF  [CAP-ELEC-SMD-D]  (hidden comment: CAP Elec 1000uF-10V-10x25-THD)
C44  value 100nF  [C-0805]  (hidden comment: CAP Cer 100nF-50V-X7R-SMD)
C45  value 100nF  [C-0805]  (hidden comment: CAP Cer 100nF-50V-X7R-SMD)
D4  Code: 1N5408  [D-DO214]  (hidden comment: Diode 1N5408-SMD)
LED4  Color: GREEN  [LED-1206-Y]  (hidden comment: LED GREEN-1206-SMD)
R37  value 2.2K  [RES-THD-1W-hori-Ls700mil]  (hidden comment: RES 2.2K-5%-1/8W-SMD)
TR1  Terminal KF?/Phoenix-2Pin-?mm-Straight/Right  [KF129-2pin]  (value not drawn)
U6  Code: 7805  [TO220-HEARSINK-1]  (hidden comment: Reg 7805-5V-THD)

### Nets
+5: C43.1 C45.1 LED4.1(A) U6.3(Vout)
+12: C42.1 C44.1 D4.2(C) U6.1(Vin)
+12_IN: D4.1(A) TR1.2
GND: C42.2 C43.2 C44.2 C45.2 R37.2 TR1.1 U6.2(GND)
NetLED4_2: LED4.2(C) R37.1

### Notes on the sheet
- (in symbol CAP-ELEC) +

### Library data of the parts
C42 = CAP-ELEC: CAPACITOR; Phone Number: 0915 8700 314; Voltage: 25V; Type: THD; Publisher: Mahdi Bagherzadeh; ComponentLink1Description: Linkedin; ComponentLink1URL: https://ir.linkedin.com/in/mahdi-bagherzade; Published Date: 9-15-2024; Size: 10x25
C43 = CAP-ELEC: CAPACITOR; Phone Number: 0915 8700 314; Voltage: 10V; Type: THD; Publisher: Mahdi Bagherzadeh; ComponentLink1Description: Linkedin; ComponentLink1URL: https://ir.linkedin.com/in/mahdi-bagherzade; Published Date: 9-15-2024; Size: 10x25
C44 C45 = CAP-CER: as C48 on sheet Interface; Publisher: Mahdi Bagherzadeh; ComponentLink1Description: Linkedin; ComponentLink1URL: https://ir.linkedin.com/in/mahdi-bagherzade; Published Date: 9-15-2024
D4 = DIODE: Phone Number: 0915 8700 314; Type: SMD; Publisher: Mahdi Bagherzadeh; ComponentLink1Description: Linkedin; ComponentLink1URL: https://ir.linkedin.com/in/mahdi-bagherzade; Published Date: 9-15-2024
LED4 = LED: Phone Number: 0915 8700 314; Type: SMD; Publisher: Mahdi Bagherzadeh; ComponentLink1Description: Linkedin; ComponentLink1URL: https://ir.linkedin.com/in/mahdi-bagherzade; Published Date: 9-15-2024; Size: 1206
R37 = RES: as R2 on sheet STM32_AUX; Publisher: Mahdi Bagherzadeh; ComponentLink1Description: Linkedin; ComponentLink1URL: https://ir.linkedin.com/in/mahdi-bagherzade; Published Date: 9-15-2024; Type: SMD
TR1 = TEMINAL-2pin: TERMINAL; Phone Number: 0915 8700 314; Publisher: Mahdi Bagherzadeh; ComponentLink1Description: Linkedin; ComponentLink1URL: https://ir.linkedin.com/in/mahdi-bagherzade; Published Date: 9-15-2024; Size: ?mm; Code: KF?/Phoenix-2Pin; Type: Straight/Right
U6 = 78Mxx: REGULATOR; Phone Number: 0915 8700 314; Voltage: 5V; Publisher: Mahdi Bagherzadeh; ComponentLink1Description: Linkedin; ComponentLink1URL: https://ir.linkedin.com/in/mahdi-bagherzade; Published Date: 9-15-2024; Type: THD

## Sheet ULN2003.SchDoc
size A; SheetNumber: 10; SheetTotal: 10
Used 8 times, as channels ULN2003_1, ULN2003_2, ULN2003_3, ULN2003_4, ULN2003_5, ULN2003_6, ULN2003_7, ULN2003_8. Parts and nets are listed once, with the designators drawn on the sheet.
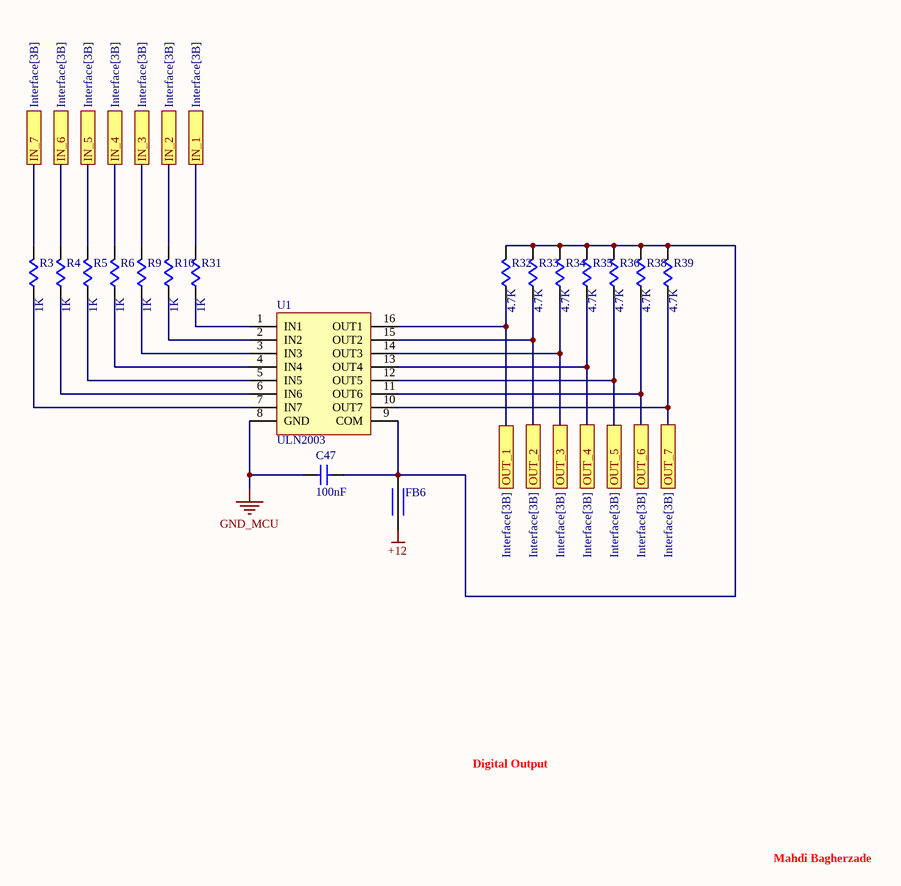
[diagram p8: ULN2003.SchDoc]

### Parts
C47  value 100nF  [C-0805]  (hidden comment: CAP Cer 100nF-50V-X7R-SMD)
FB6  Ferrite Bead SMD  [FB-0805]  (value not drawn)
R3  value 1K  [R-0805]  (hidden comment: RES 1K-5%-1/8W-SMD)
R4  value 1K  [R-0805]  (hidden comment: RES 1K-5%-1/8W-SMD)
R5  value 1K  [R-0805]  (hidden comment: RES 1K-5%-1/8W-SMD)
R6  value 1K  [R-0805]  (hidden comment: RES 1K-5%-1/8W-SMD)
R9  value 1K  [R-0805]  (hidden comment: RES 1K-5%-1/8W-SMD)
R10  value 1K  [R-0805]  (hidden comment: RES 1K-5%-1/8W-SMD)
R31  value 1K  [R-0805]  (hidden comment: RES 1K-5%-1/8W-SMD)
R32  value 4.7K  [R-0805]  (hidden comment: RES 4.7K-5%-1/8W-SMD)
R33  value 4.7K  [R-0805]  (hidden comment: RES 4.7K-5%-1/8W-SMD)
R34  value 4.7K  [R-0805]  (hidden comment: RES 4.7K-5%-1/8W-SMD)
R35  value 4.7K  [R-0805]  (hidden comment: RES 4.7K-5%-1/8W-SMD)
R36  value 4.7K  [R-0805]  (hidden comment: RES 4.7K-5%-1/8W-SMD)
R38  value 4.7K  [R-0805]  (hidden comment: RES 4.7K-5%-1/8W-SMD)
R39  value 4.7K  [R-0805]  (hidden comment: RES 4.7K-5%-1/8W-SMD)
U1  ULN2003  [SOIC16]

### Ports
IN_1 (see Interface[3B]), IN_2 (see Interface[3B]), IN_3 (see Interface[3B]), IN_4 (see Interface[3B]), IN_5 (see Interface[3B]), IN_6 (see Interface[3B]), IN_7 (see Interface[3B]), OUT_1 (see Interface[3B]), OUT_2 (see Interface[3B]), OUT_3 (see Interface[3B]), OUT_4 (see Interface[3B]), OUT_5 (see Interface[3B]), OUT_6 (see Interface[3B]), OUT_7 (see Interface[3B])

### Nets
+12: FB6.1
GND_MCU: C47.1 U1.8(GND)
IN_1: R31.2 ; port IN_1
IN_2: R10.2 ; port IN_2
IN_3: R9.2 ; port IN_3
IN_4: R6.2 ; port IN_4
IN_5: R5.2 ; port IN_5
IN_6: R4.2 ; port IN_6
IN_7: R3.2 ; port IN_7
OUT_1: R32.1 U1.16(OUT1) ; port OUT_1
OUT_2: R33.1 U1.15(OUT2) ; port OUT_2
OUT_3: R34.1 U1.14(OUT3) ; port OUT_3
OUT_4: R35.1 U1.13(OUT4) ; port OUT_4
OUT_5: R36.1 U1.12(OUT5) ; port OUT_5
OUT_6: R38.1 U1.11(OUT6) ; port OUT_6
OUT_7: R39.1 U1.10(OUT7) ; port OUT_7
NetC47_2: C47.2 FB6.2 R32.2 R33.2 R34.2 R35.2 R36.2 R38.2 R39.2 U1.9(COM)
NetR3_1: R3.1 U1.7(IN7)
NetR4_1: R4.1 U1.6(IN6)
NetR5_1: R5.1 U1.5(IN5)
NetR6_1: R6.1 U1.4(IN4)
NetR9_1: R9.1 U1.3(IN3)
NetR10_1: R10.1 U1.2(IN2)
NetR31_1: R31.1 U1.1(IN1)

### Channels
ULN2003_1: designators end in _1; ports IN_1=MCU_RELAY1 IN_2=MCU_LED1 IN_3=MCU_RELAY2 IN_4=MCU_LED2 IN_5=MCU_RELAY3 IN_6=MCU_LED3 IN_7=MCU_RELAY4 OUT_1=RELAY1 OUT_2=LED1 OUT_3=RELAY2 OUT_4=LED2 OUT_5=RELAY3 OUT_6=LED3 OUT_7=RELAY4
ULN2003_2: designators end in _2; ports IN_1=MCU_LED4 IN_2=MCU_RELAY5 IN_3=MCU_LED5 IN_4=MCU_RELAY6 IN_5=MCU_LED6 IN_6=MCU_RELAY7 IN_7=MCU_LED7 OUT_1=LED4 OUT_2=RELAY5 OUT_3=LED5 OUT_4=RELAY6 OUT_5=LED6 OUT_6=RELAY7 OUT_7=LED7
ULN2003_3: designators end in _3; ports IN_1=MCU_RELAY8 IN_2=MCU_LED8 IN_3=MCU_RELAY9 IN_4=MCU_LED9 IN_5=MCU_RELAY10 IN_6=MCU_LED10 IN_7=MCU_RELAY11 OUT_1=RELAY8 OUT_2=LED8 OUT_3=RELAY9 OUT_4=LED9 OUT_5=RELAY10 OUT_6=LED10 OUT_7=RELAY11
ULN2003_4: designators end in _4; ports IN_1=MCU_LED11 IN_2=MCU_RELAY12 IN_3=MCU_LED12 IN_4=MCU_RELAY13 IN_5=MCU_LED13 IN_6=MCU_RELAY14 IN_7=MCU_LED14 OUT_1=LED11 OUT_2=RELAY12 OUT_3=LED12 OUT_4=RELAY13 OUT_5=LED13 OUT_6=RELAY14 OUT_7=LED14
ULN2003_5: designators end in _5; ports IN_1=MCU_RELAY15 IN_2=MCU_LED15 IN_3=MCU_RELAY16 IN_4=MCU_LED16 IN_5=MCU_RELAY17 IN_6=MCU_LED17 IN_7=MCU_RELAY18 OUT_1=RELAY15 OUT_2=LED15 OUT_3=RELAY16 OUT_4=LED16 OUT_5=RELAY17 OUT_6=LED17 OUT_7=RELAY18
ULN2003_6: designators end in _6; ports IN_1=MCU_LED18 IN_2=MCU_RELAY19 IN_3=MCU_LED19 IN_4=MCU_RELAY20 IN_5=MCU_LED20 IN_6=MCU_RELAY21 IN_7=MCU_LED21 OUT_1=LED18 OUT_2=RELAY19 OUT_3=LED19 OUT_4=RELAY20 OUT_5=LED20 OUT_6=RELAY21 OUT_7=LED21
ULN2003_7: designators end in _7; ports IN_1=MCU_RELAY22 IN_2=MCU_LED22 IN_3=MCU_RELAY23 IN_4=MCU_LED23 IN_5=MCU_RELAY24 IN_6=MCU_LED24 IN_7=MCU_RELAY25 OUT_1=RELAY22 OUT_2=LED22 OUT_3=RELAY23 OUT_4=LED23 OUT_5=RELAY24 OUT_6=LED24 OUT_7=RELAY25
ULN2003_8: designators end in _8; ports IN_1=MCU_LED25 IN_2=MCU_RELAY26 IN_3=MCU_LED26 IN_4=MCU_RELAY27 IN_5=MCU_LED27 IN_6=MCU_RELAY28 IN_7=MCU_LED28 OUT_1=LED25 OUT_2=RELAY26 OUT_3=LED26 OUT_4=RELAY27 OUT_5=LED27 OUT_6=RELAY28 OUT_7=LED28

### Notes on the sheet
- Digital Output
- Mahdi Bagherzade

### Library data of the parts
C47 = CAP-CER: as C48 on sheet Interface; Publisher: Mahdi Bagherzadeh; ComponentLink1Description: Linkedin; ComponentLink1URL: https://ir.linkedin.com/in/mahdi-bagherzade; Published Date: 9-15-2024
FB6 = FERRITE BEAD: INDUCATOR; Phone Number: 0915 8700 314; Publisher: Mahdi Bagherzadeh; ComponentLink1Description: Linkedin; ComponentLink1URL: https://ir.linkedin.com/in/mahdi-bagherzade; Published Date: 9-15-2024; Type: SMD
R3-R6 R9 R10 R31-R36 R38 R39 = RES: as R28 on sheet STM32_AUX; Publisher: Mahdi Bagherzadeh; ComponentLink1Description: Linkedin; ComponentLink1URL: https://ir.linkedin.com/in/mahdi-bagherzade; Published Date: 9-15-2024; Type: SMD
U1 = ULN2003: IC; Phone Number: 0915 8700 314; Publisher: Mahdi Bagherzadeh; ComponentLink1Description: Linkedin; ComponentLink1URL: https://ir.linkedin.com/in/mahdi-bagherzade; Published Date: 9-15-2024

## Sheet Channel.SchDoc
size A; SheetNumber: 3; SheetTotal: 10
Used 28 times, as channels CHANNEL1, CHANNEL2, CHANNEL3, CHANNEL4, CHANNEL5, CHANNEL6, CHANNEL7, CHANNEL8, CHANNEL9, CHANNEL10, CHANNEL11, CHANNEL12, CHANNEL13, CHANNEL14, CHANNEL15, CHANNEL16, CHANNEL17, CHANNEL18, CHANNEL19, CHANNEL20, CHANNEL21, CHANNEL22, CHANNEL23, CHANNEL24, CHANNEL25, CHANNEL26, CHANNEL27, CHANNEL28. Parts and nets are listed once, with the designators drawn on the sheet.
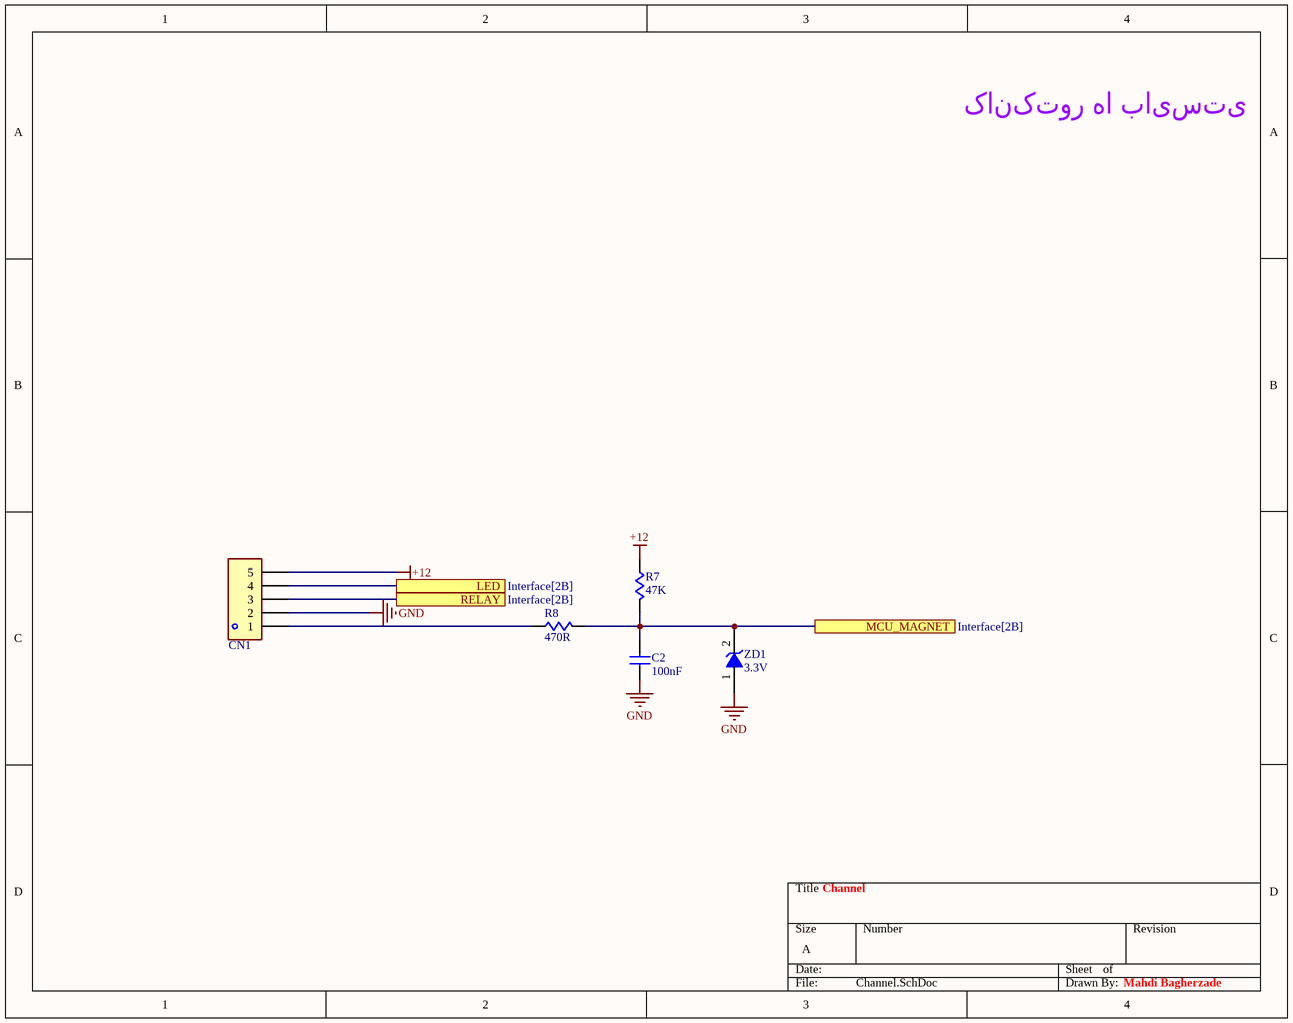
[diagram p9: Channel.SchDoc]

### Parts
C2  value 100nF  [C-0805]  (hidden comment: CAP Cer 100nF-50V-X7R-SMD)
CN1  Connector XH/VH/TE-Straight/Right-THD/SMD-?mm  [XH-5]  (value not drawn)
R7  value 47K  [R-0805]
R8  value 470R  [R-0805]
ZD1  Voltage: 3.3V  [SOD80]  (hidden comment: Zener -3.3V-SMD)

### Ports
LED (see Interface[2B]), MCU_MAGNET (see Interface[2B]), RELAY (see Interface[2B])

### Nets
+12: CN1.5 R7.1
GND: C2.2 CN1.2 ZD1.1(A)
LED: CN1.4 ; port LED
MCU_MAGNET: C2.1 R7.2 R8.2 ZD1.2(C) ; port MCU_MAGNET
RELAY: CN1.3 ; port RELAY
NetCN1_1: CN1.1 R8.1

### Channels
CHANNEL1: designators end in _1; ports LED=LED1 MCU_MAGNET=MCU_MAGNET1 RELAY=RELAY1
CHANNEL2: designators end in _2; ports LED=LED2 MCU_MAGNET=MCU_MAGNET2 RELAY=RELAY2
CHANNEL3: designators end in _3; ports LED=LED3 MCU_MAGNET=MCU_MAGNET3 RELAY=RELAY3
CHANNEL4: designators end in _4; ports LED=LED4 MCU_MAGNET=MCU_MAGNET4 RELAY=RELAY4
CHANNEL5: designators end in _5; ports LED=LED5 MCU_MAGNET=MCU_MAGNET5 RELAY=RELAY5
CHANNEL6: designators end in _6; ports LED=LED6 MCU_MAGNET=MCU_MAGNET6 RELAY=RELAY6
CHANNEL7: designators end in _7; ports LED=LED7 MCU_MAGNET=MCU_MAGNET7 RELAY=RELAY7
CHANNEL8: designators end in _8; ports LED=LED8 MCU_MAGNET=MCU_MAGNET8 RELAY=RELAY8
CHANNEL9: designators end in _9; ports LED=LED9 MCU_MAGNET=MCU_MAGNET9 RELAY=RELAY9
CHANNEL10: designators end in _10; ports LED=LED10 MCU_MAGNET=MCU_MAGNET10 RELAY=RELAY10
CHANNEL11: designators end in _11; ports LED=LED11 MCU_MAGNET=MCU_MAGNET11 RELAY=RELAY11
CHANNEL12: designators end in _12; ports LED=LED12 MCU_MAGNET=MCU_MAGNET12 RELAY=RELAY12
CHANNEL13: designators end in _13; ports LED=LED13 MCU_MAGNET=MCU_MAGNET13 RELAY=RELAY13
CHANNEL14: designators end in _14; ports LED=LED14 MCU_MAGNET=MCU_MAGNET14 RELAY=RELAY14
CHANNEL15: designators end in _15; ports LED=LED15 MCU_MAGNET=MCU_MAGNET15 RELAY=RELAY15
CHANNEL16: designators end in _16; ports LED=LED16 MCU_MAGNET=MCU_MAGNET16 RELAY=RELAY16
CHANNEL17: designators end in _17; ports LED=LED17 MCU_MAGNET=MCU_MAGNET17 RELAY=RELAY17
CHANNEL18: designators end in _18; ports LED=LED18 MCU_MAGNET=MCU_MAGNET18 RELAY=RELAY18
CHANNEL19: designators end in _19; ports LED=LED19 MCU_MAGNET=MCU_MAGNET19 RELAY=RELAY19
CHANNEL20: designators end in _20; ports LED=LED20 MCU_MAGNET=MCU_MAGNET20 RELAY=RELAY20
CHANNEL21: designators end in _21; ports LED=LED21 MCU_MAGNET=MCU_MAGNET21 RELAY=RELAY21
CHANNEL22: designators end in _22; ports LED=LED22 MCU_MAGNET=MCU_MAGNET22 RELAY=RELAY22
CHANNEL23: designators end in _23; ports LED=LED23 MCU_MAGNET=MCU_MAGNET23 RELAY=RELAY23
CHANNEL24: designators end in _24; ports LED=LED24 MCU_MAGNET=MCU_MAGNET24 RELAY=RELAY24
CHANNEL25: designators end in _25; ports LED=LED25 MCU_MAGNET=MCU_MAGNET25 RELAY=RELAY25
CHANNEL26: designators end in _26; ports LED=LED26 MCU_MAGNET=MCU_MAGNET26 RELAY=RELAY26
CHANNEL27: designators end in _27; ports LED=LED27 MCU_MAGNET=MCU_MAGNET27 RELAY=RELAY27
CHANNEL28: designators end in _28; ports LED=LED28 MCU_MAGNET=MCU_MAGNET28 RELAY=RELAY28

### Notes on the sheet
- کانکتور ها بایستی در لبه بورد قرار بگیرند
- Channel
- Mahdi Bagherzade

### Library data of the parts
C2 = CAP-CER: as C48 on sheet Interface; Publisher: Mahdi Bagherzadeh; ComponentLink1Description: Linkedin; ComponentLink1URL: https://ir.linkedin.com/in/mahdi-bagherzade; Published Date: 9-15-2024
CN1 = CN-5pin: CONNECTOR; Phone Number: 0915 8700 314; Publisher: Mahdi Bagherzadeh; ComponentLink1Description: Linkedin; ComponentLink1URL: https://ir.linkedin.com/in/mahdi-bagherzade; Published Date: 9-15-2024; Type: Straight/Right-THD/SMD; Size: ?mm; Value: XH/VH/TE
R7 R8 = RES: as R2 on sheet STM32_AUX; Publisher: Mahdi Bagherzadeh; ComponentLink1Description: Linkedin; ComponentLink1URL: https://ir.linkedin.com/in/mahdi-bagherzade; Published Date: 9-15-2024
ZD1 = DIODE-ZENER: DIODE; Phone Number: 0915 8700 314; Power: Minimelf; Publisher: Mahdi Bagherzadeh; ComponentLink1Description: Linkedin; ComponentLink1URL: https://ir.linkedin.com/in/mahdi-bagherzade; Published Date: 9-15-2024; Type: SMD